# Altium project ENGG2800 Team 03 PCB.PrjPcb
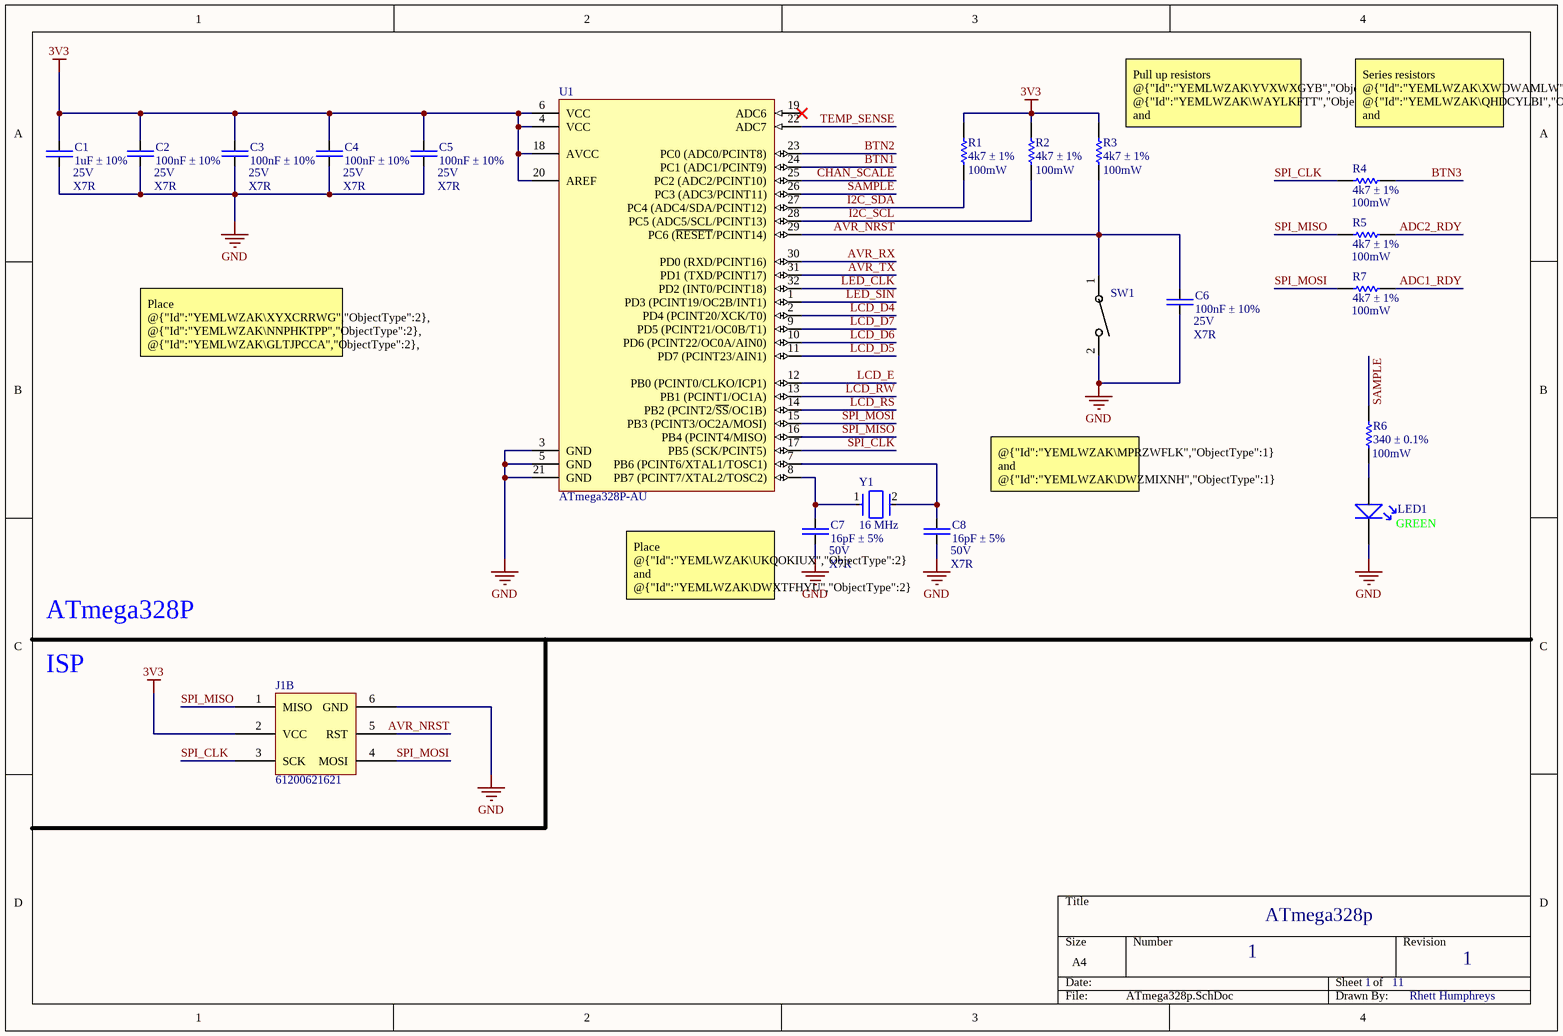
[diagram p0: ATmega328p.SchDoc]
11 sheets, 237 parts. Net scope: global (net labels, ports and power ports of the same name join across sheets).
Board file: PCB.PcbDoc
Sheets:
  ATmega328p.SchDoc
  Seeeduino and Temp.SchDoc
  Channels [1,2].SchDoc
  Channels [3,4].SchDoc
  ADC.SchDoc
  Alarms and Buttons.SchDoc
  Accelerometer.SchDoc
  LCD.SchDoc
  Power.SchDoc
  Hardware.SchDoc
  Cables.SchDoc

## Sheet ATmega328p.SchDoc: ATmega328p and Seeeduino
size A4; DocumentNumber: 1; Revision: 1; SheetNumber: 1; SheetTotal: 11

### Parts
C1  1uF ± 10%  [CAP-0805]
C2  100nF ± 10%  [CAP-0603]
C3  100nF ± 10%  [CAP-0603]
C4  100nF ± 10%  [CAP-0603]
C5  100nF ± 10%  [CAP-0603]
C6  100nF ± 10%  [CAP-0603]
C7  16pF ± 5%  [CAP-0603]
C8  16pF ± 5%  [CAP-0603]
J1  61200621621  [61200621621]  (part B of 2)
LED1  (no value)  [0603 LED]
R1  4k7 ± 1%  [RES-0603]
R2  4k7 ± 1%  [RES-0603]
R3  4k7 ± 1%  [RES-0603]
R4  4k7 ± 1%  [RES-0603]
R5  4k7 ± 1%  [RES-0603]
R6  340 ± 0.1%  [RES-0603]
R7  4k7 ± 1%  [RES-0603]
SW1  PTS636SK43JSMTRLFS  [SW_PTS636S-J_CNK]  (value not drawn)
U1  ATmega328P-AU  [32A_M]
Y1  16 MHz  [FP-ABM7-MFG]

### Nets
3V3: C1.2 C2.2 C3.2 C4.2 C5.2 J1.2(VCC) R1.1 R2.1 R3.1 U1.4(VCC) U1.6(VCC) U1.18(AVCC) U1.20(AREF)
GND: C1.1 C2.1 C3.1 C4.1 C5.1 C6.1 C7.1 C8.1 J1.6(GND) LED1.2 SW1.2 U1.3(GND) U1.5(GND) U1.21(GND)
ADC1_RDY: R7.2
ADC2_RDY: R5.2
AVR_NRST: C6.2 J1.5(RST) R3.2 SW1.1 U1.29(PC6_(~{RESET}/PCINT14))
AVR_RX: U1.30(PD0_(RXD/PCINT16))
AVR_TX: U1.31(PD1_(TXD/PCINT17))
BTN1: U1.24(PC1_(ADC1/PCINT9))
BTN2: U1.23(PC0_(ADC0/PCINT8))
BTN3: R4.2
CHAN_SCALE: U1.25(PC2_(ADC2/PCINT10))
I2C_SCL: R2.2 U1.28(PC5_(ADC5/SCL/PCINT13))
I2C_SDA: R1.2 U1.27(PC4_(ADC4/SDA/PCINT12))
LCD_D4: U1.2(PD4_(PCINT20/XCK/T0))
LCD_D5: U1.11(PD7_(PCINT23/AIN1))
LCD_D6: U1.10(PD6_(PCINT22/OC0A/AIN0))
LCD_D7: U1.9(PD5_(PCINT21/OC0B/T1))
LCD_E: U1.12(PB0_(PCINT0/CLKO/ICP1))
LCD_RS: U1.14(PB2_(PCINT2/~{SS}/OC1B))
LCD_RW: U1.13(PB1_(PCINT1/OC1A))
LED_CLK: U1.32(PD2_(INT0/PCINT18))
LED_SIN: U1.1(PD3_(PCINT19/OC2B/INT1))
SAMPLE: R6.1 U1.26(PC3_(ADC3/PCINT11))
SPI_CLK: J1.3(SCK) R4.1 U1.17(PB5_(SCK/PCINT5))
SPI_MISO: J1.1(MISO) R5.1 U1.16(PB4_(PCINT4/MISO))
SPI_MOSI: J1.4(MOSI) R7.1 U1.15(PB3_(PCINT3/OC2A/MOSI))
TEMP_SENSE: U1.22(ADC7)
NetC7_2: C7.2 U1.8(PB7_(PCINT7/XTAL2/TOSC2)) Y1.1
NetC8_2: C8.2 U1.7(PB6_(PCINT6/XTAL1/TOSC1)) Y1.2
NetLED1_1: LED1.1 R6.2

Not connected (* = marked no-connect by the designer): U1 19(ADC6)*

### Notes on the sheet
- (near C1) 25V
- (near C2) 25V
- (near C3) 25V
- (near C4) 25V
- (near C5) 25V
- (near R1) 100mW
- (near R2) 100mW
- (near R3) 100mW
- (near R3) Pull up resistors @{"Id":"YEMLWZAK\YVXWXGYB","ObjectType":2}, @{"Id":"YEMLWZAK\WAYLKFTT","ObjectType":2} and @{"Id":"YEMLWZAK\NGWYUVVG","ObjectType":2} for I2C bus signals @{"Id":"JIGDRHWK\IIGRDYOB","ObjectType":1}, @{"Id":"JIGDRHWK\FTFHPBWY","ObjectType":1} and @{"Id":"YEMLWZAK\QSTGJNDM","ObjectType":1}
- Series resistors @{"Id":"YEMLWZAK\XWDWAMLW","ObjectType":2}, @{"Id":"YEMLWZAK\QHDCYLBI","ObjectType":2} and @{"Id":"YEMLWZAK\KNMCQFHG","ObjectType":2} to protect lines connected to SPI programming lines
- (near C1) X7R
- (near C2) X7R
- (near C3) X7R
- (near C4) X7R
- (near C5) X7R
- 100mW
- (near R7) 100mW
- Place @{"Id":"YEMLWZAK\XYXCRRWG","ObjectType":2}, @{"Id":"YEMLWZAK\NNPHKTPP","ObjectType":2}, @{"Id":"YEMLWZAK\GLTJPCCA","ObjectType":2}, @{"Id":"YEMLWZAK\HCRQOYSD","ObjectType":2} as close as possible to VCC, AVCC and AREF pins of @{"Id":"YEMLWZAK\HIGJTEGZ","ObjectType":2} as possible. Place @{"Id":"YEMLWZAK\RMDZLOSG","ObjectType":2} relatively close to @{"Id":"YEMLWZAK\HIGJTEGZ","ObjectType":2}
- (near C6) X7R
- (near C6) 25V
- @{"Id":"YEMLWZAK\MPRZWFLK","ObjectType":1} and @{"Id":"YEMLWZAK\DWZMIXNH","ObjectType":1} have been swapped to assist with routing
- (near R6) 100mW
- (near C7) X7R
- (near C7) 50V
- (near C8) X7R
- (near C8) 50V
- (near LED1) GREEN
- ATmega328P
- Place @{"Id":"YEMLWZAK\UKQOKIUX","ObjectType":2} and @{"Id":"YEMLWZAK\DWXTFHYU","ObjectType":2} as close to @{"Id":"YEMLWZAK\STRTPVYI","ObjectType":2} as possible. Place @{"Id":"YEMLWZAK\STRTPVYI","ObjectType":2} as close to @{"Id":"YEMLWZAK\HIGJTEGZ","ObjectType":2} as possible
- ISP
- ATmega328p
- 1
- 11
- Rhett Humphreys

### Library data of the parts
C1 = CAP-0805: Capacitor chip unpolarized. 0603
C2-C8 = CAP-0603: Capacitor chip unpolarized. 0603
LED1 = 0603 LED
R1-R7 = RES-0603: Resistor chip. 0603
SW1 = PTS636SK43JSMTRLFS: No Description Available; Mfr_Name: C&K Components; Type: Tactile Switches
U1 = CMP-0095-00269-2: 8-bit AVR Microcontroller, 32KB Flash, 1KB EEPROM, 2KB SRAM, 32-pin TQFP, Industrial Grade (-40°C to 85°C); PackageDescription: 32-Lead, 7x7x1.0 mm Body, 0.8mm Lead Pitch, Thin Profile Plastic Quad Flat Package (TQFP); DatasheetVersion: revD, May-2011; RevisionNote: DatasheetVersion & PackageVersion updated. URLs added.; ComponentLink1URL: http://www.atmel.com/; ComponentLink2Description: ATmega48A/48PA/88A/88PA/168A/168PA/328/328P Datasheet; Code_JEDEC: MS-026-ABA; ComponentLink1Description: Manufacturer URL; PackageReference: 32A; ComponentLink3Description: ATmega48A/48PA/88A/88PA/168A/168PA/328/328P Summary; ComponentLink2URL: http://www.atmel.com/dyn/resources/prod_documents/doc8271.pdf; PackageVersion: revC, Oct-2010; ComponentLink3URL: http://www.atmel.com/dyn/resources/prod_documents/8271S.pdf
Y1 = CMP-27762-000095-1: Crystal 16MHz ±20ppm 18pF SMD-2 6mm x 3.5mm; ESR (Equivalent Series Resistance): 50R; Frequency Stability: 30ppm; Width: 3.3mm; Frequency: 16MHz; Radiation Hardening: No; Height: 0.055inch; Tolerance: 20ppm; Length: 6mm; Case/Package: CSMD; Lead Free: Lead Free; Min Operating Temperature: -40°C; Termination: SMD/SMT; Operating Frequency: 16 MHz; Resistor Type: Ceramic; Packaging: Tape and Reel; Mount: Surface Mount; Load Capacitance: 18pF; Frequency Tolerance: 20ppm; Depth: 3.5mm; Series: ABM7; Package Quantity: 1000; Max Operating Temperature: 85°C; Number of Pins: 2

## Sheet Seeeduino and Temp.SchDoc
size A4; DocumentNumber: 2; SheetNumber: 2; SheetTotal: 11
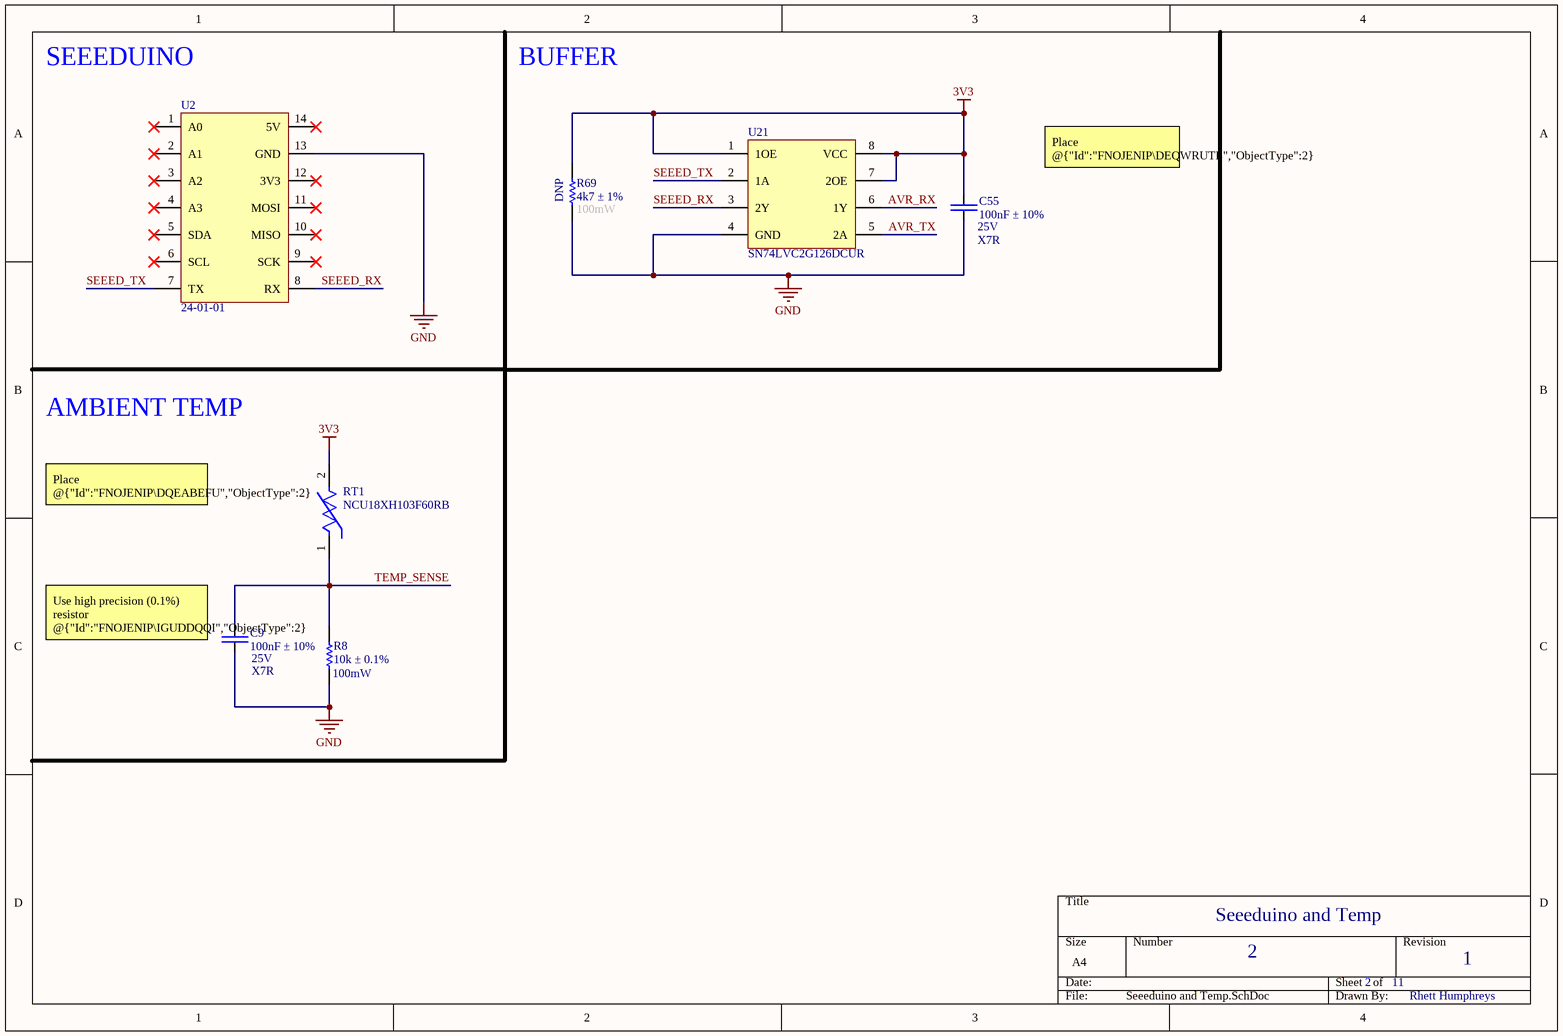
[diagram p1: Seeeduino and Temp.SchDoc]

### Parts
C9  100nF ± 10%  [CAP-0603]
C55  100nF ± 10%  [CAP-0603]
R8  10k ± 0.1%  [RES-0603]
R69  4k7 ± 1%  [RES-0603]
RT1  NCU18XH103F60RB  [FP-NCU18-0_15-MFG]
U2  24-01-01  [SEEEDUINO XIAO]
U21  SN74LVC2G126DCUR  [TSSOP50P310X90-8N]

### Nets
3V3: C55.2 R69.1 RT1.2 U21.1(1OE) U21.7(2OE) U21.8(VCC)
GND: C9.1 C55.1 R8.2 R69.2 U2.13(GND) U21.4(GND)
AVR_RX: U21.6(1Y)
AVR_TX: U21.5(2A)
SEEED_RX: U2.8(RX) U21.3(2Y)
SEEED_TX: U2.7(TX) U21.2(1A)
TEMP_SENSE: C9.2 R8.1 RT1.1

Not connected (* = marked no-connect by the designer): U2 1(A0)* 2(A1)* 3(A2)* 4(A3)* 5(SDA)* 6(SCL)* 9(SCK)* 10(MISO)* 11(MOSI)* 12(3V3)* 14(5V)*

### Notes on the sheet
- SEEEDUINO
- BUFFER
- Place @{"Id":"FNOJENIP\DEQWRUTL","ObjectType":2} as close as possible to @{"Id":"FNOJENIP\KYCZRSMO","ObjectType":2}
- (near R69) DNP
- (near R69) 100mW
- (near C55) X7R
- (near C55) 25V
- AMBIENT TEMP
- Place @{"Id":"FNOJENIP\DQEABEFU","ObjectType":2} as close as possible to @{"Id":"YEMLWZAK\HIGJTEGZ","ObjectType":2}
- (near C9) Use high precision (0.1%) resistor @{"Id":"FNOJENIP\IGUDDQQI","ObjectType":2} to form divider with @{"Id":"FNOJENIP\MLOTZGQT","ObjectType":2}
- (near C9) X7R
- (near C9) 25V
- (near R8) 100mW
- Seeeduino and Temp
- 2
- 11
- 1
- Rhett Humphreys

### Library data of the parts
C9 C55 = CAP-0603: Capacitor chip unpolarized. 0603
R8 R69 = RES-0603: Resistor chip. 0603
RT1 = CMP-06022-000443-2: THERMISTOR NTC; Max Operating Temperature: 125°C; REACH SVHC: No SVHC; Case/Package: 0603; Min Operating Temperature: -40°C; RoHS Compliant: Yes; Case Code (Imperial): 0603; Case Code (Metric): 1608
U2 = SEEDUINO XIAO

## Sheet Channels [1,2].SchDoc
size A4; DocumentNumber: 3; SheetNumber: 3; SheetTotal: 11
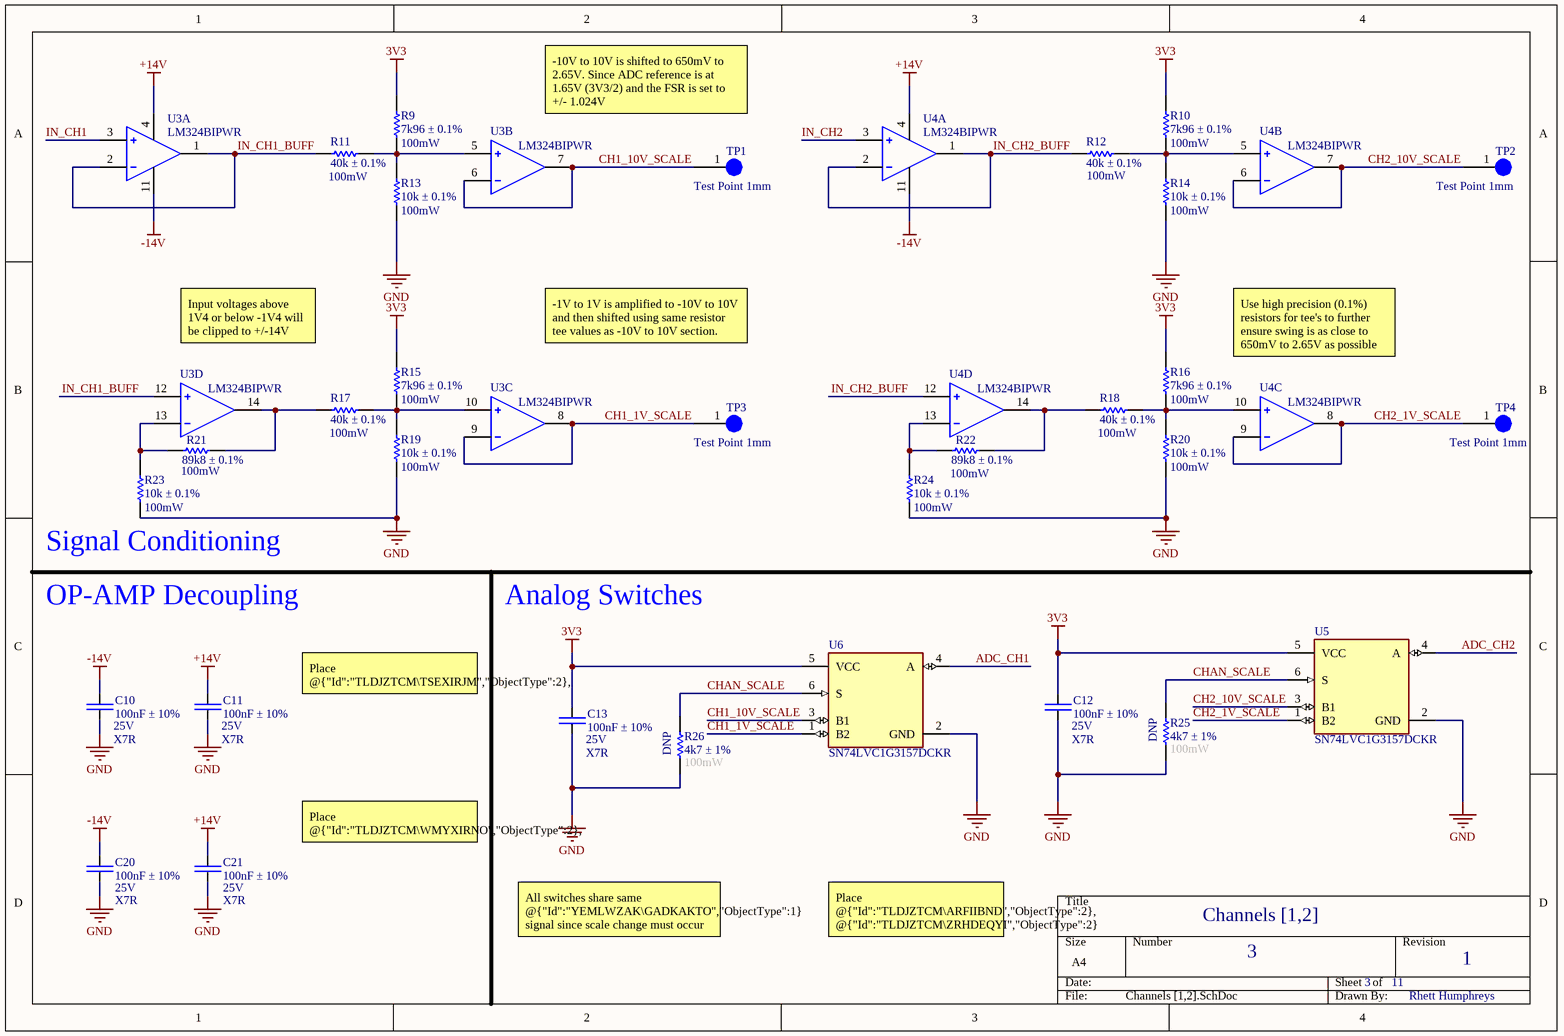
[diagram p2: Channels [1,2].SchDoc]

### Parts
C10  100nF ± 10%  [CAP-0603]
C11  100nF ± 10%  [CAP-0603]
C12  100nF ± 10%  [CAP-0603]
C13  100nF ± 10%  [CAP-0603]
C20  100nF ± 10%  [CAP-0603]
C21  100nF ± 10%  [CAP-0603]
R9  7k96 ± 0.1%  [RES-0603]
R10  7k96 ± 0.1%  [RES-0603]
R11  40k ± 0.1%  [RES-0603]
R12  40k ± 0.1%  [RES-0603]
R13  10k ± 0.1%  [RES-0603]
R14  10k ± 0.1%  [RES-0603]
R15  7k96 ± 0.1%  [RES-0603]
R16  7k96 ± 0.1%  [RES-0603]
R17  40k ± 0.1%  [RES-0603]
R18  40k ± 0.1%  [RES-0603]
R19  10k ± 0.1%  [RES-0603]
R20  10k ± 0.1%  [RES-0603]
R21  89k8 ± 0.1%  [RES-0603]
R22  89k8 ± 0.1%  [RES-0603]
R23  10k ± 0.1%  [RES-0603]
R24  10k ± 0.1%  [RES-0603]
R25  4k7 ± 1%  [RES-0603]
R26  4k7 ± 1%  [RES-0603]
TP1  Test Point 1mm  [Test Point 1mm]
TP2  Test Point 1mm  [Test Point 1mm]
TP3  Test Point 1mm  [Test Point 1mm]
TP4  Test Point 1mm  [Test Point 1mm]
U3  LM324BIPWR  [FP-PW0014A-MFG]  (parts A,B,C,D of 4)
U4  LM324BIPWR  [FP-PW0014A-MFG]  (parts A,B,C,D of 4)
U5  SN74LVC1G3157DCKR  [FP-DCK0006A-IPC_B]
U6  SN74LVC1G3157DCKR  [FP-DCK0006A-IPC_B]

### Nets
3V3: C12.2 C13.2 R9.1 R10.1 R15.1 R16.1 U5.5(VCC) U6.5(VCC)
+14V: C11.2 C21.2 U3.4(VCC+) U4.4(VCC+)
-14V: C10.2 C20.2 U3.11(VCC-) U4.11(VCC-)
GND: C10.1 C11.1 C12.1 C13.1 C20.1 C21.1 R13.2 R14.2 R19.2 R20.2 R23.2 R24.2 R25.2 R26.2 U5.2(GND) U6.2(GND)
ADC_CH1: U6.4(A)
ADC_CH2: U5.4(A)
CH1_1V_SCALE: TP3.1 U3.8(3OUT) U3.9(3IN-) U6.1(B2)
CH1_10V_SCALE: TP1.1 U3.6(2IN-) U3.7(2OUT) U6.3(B1)
CH2_1V_SCALE: TP4.1 U4.8(3OUT) U4.9(3IN-) U5.1(B2)
CH2_10V_SCALE: TP2.1 U4.6(2IN-) U4.7(2OUT) U5.3(B1)
CHAN_SCALE: R25.1 R26.1 U5.6(S) U6.6(S)
IN_CH1: U3.3(1IN+)
IN_CH1_BUFF: R11.2 U3.1(1OUT) U3.2(1IN-) U3.12(4IN+)
IN_CH2: U4.3(1IN+)
IN_CH2_BUFF: R12.2 U4.1(1OUT) U4.2(1IN-) U4.12(4IN+)
NetR9_2: R9.2 R11.1 R13.1 U3.5(2IN+)
NetR10_2: R10.2 R12.1 R14.1 U4.5(2IN+)
NetR15_2: R15.2 R17.1 R19.1 U3.10(3IN+)
NetR16_2: R16.2 R18.1 R20.1 U4.10(3IN+)
NetR17_2: R17.2 R21.1 U3.14(4OUT)
NetR18_2: R18.2 R22.1 U4.14(4OUT)
NetR21_2: R21.2 R23.1 U3.13(4IN-)
NetR22_2: R22.2 R24.1 U4.13(4IN-)

### Notes on the sheet
- -10V to 10V is shifted to 650mV to 2.65V. Since ADC reference is at 1.65V (3V3/2) and the FSR is set to +/- 1.024V
- (near R11) 100mW
- (near R9) 100mW
- (near R12) 100mW
- (near R10) 100mW
- (near R13) 100mW
- (near R14) 100mW
- Input voltages above 1V4 or below -1V4 will be clipped to +/-14V
- -1V to 1V is amplified to -10V to 10V and then shifted using same resistor tee values as -10V to 10V section.
- Use high precision (0.1%) resistors for tee's to further ensure swing is as close to 650mV to 2.65V as possible
- (near R17) 100mW
- (near R15) 100mW
- (near R18) 100mW
- (near R16) 100mW
- (near R23) 100mW
- (near R21) 100mW
- (near R19) 100mW
- (near R24) 100mW
- (near R22) 100mW
- (near R20) 100mW
- (near R23) Signal Conditioning
- OP-AMP Decoupling
- Analog Switches
- Place @{"Id":"TLDJZTCM\TSEXIRJM","ObjectType":2}, @{"Id":"TLDJZTCM\LSKHBFHO","ObjectType":2} as close as possible to @{"Id":"TLDJZTCM\QXNYIEIL","ObjectType":2}
- (near C10) X7R
- (near C10) 25V
- (near C11) X7R
- (near C11) 25V
- (near C13) X7R
- (near C13) 25V
- (near R26) DNP
- (near R26) 100mW
- (near C12) X7R
- (near C12) 25V
- (near R25) DNP
- (near R25) 100mW
- Place @{"Id":"TLDJZTCM\WMYXIRNO","ObjectType":2}, @{"Id":"TLDJZTCM\EVSPQWQB","ObjectType":2} as close as possible to @{"Id":"TLDJZTCM\DEGCNGJX","ObjectType":2}
- (near C20) X7R
- (near C20) 25V
- (near C21) X7R
- (near C21) 25V
- Channels [1,2]
- All switches share same @{"Id":"YEMLWZAK\GADKAKTO","ObjectType":1} signal since scale change must occur on all channels.
- Place @{"Id":"TLDJZTCM\ARFIIBND","ObjectType":2}, @{"Id":"TLDJZTCM\ZRHDEQYI","ObjectType":2} as close as possible to @{"Id":"TLDJZTCM\ILIOHQVR","ObjectType":2}, @{"Id":"TLDJZTCM\NPQFYXBL","ObjectType":2} respectively.
- 3
- 11
- 1
- Rhett Humphreys

### Library data of the parts
C10-C13 C20 C21 = CAP-0603: Capacitor chip unpolarized. 0603
R9-R26 = RES-0603: Resistor chip. 0603
U3 U4 = CMP-00370-131314463-1: LM324BIPWR Quad, 36-V, 1.2-MHz 3-mV offset voltage operational amplifier 14-TSSOP -40 to 85; Manufacturer Lifecycle Status: ACTIVE; Number of Pins: 14; NexarPartId: 131314463; Height: 1.2mm; Thickness: 1mm; Length: 5mm; Lifecycle Status: Production; Width: 4.4mm; Case/Package: TSSOP
U5 U6 = CMP-0859-00516-4: IC SWITCH SPDT SC70-6; Nominal Supply Current: 10uA; Number of Inputs: 1; Supply Type: Single; Operating Supply Current: 1uA; Polarity: Non-Inverting; Low Level Output Current: 128mA; Bandwidth: 300MHz; Max Supply Voltage: 5.5V; Turn-Off Delay Time: 3.8ns; Turn-On Delay Time: 5.7ns; Number of Outputs: 2; Min Supply Voltage: 1.65V; Propagation Delay: 300ps; On-State Resistance: 15R; Mount: Surface Mount; Throw Configuration: SPDT; Min Operating Temperature: -40°C; Radiation Hardening: No; Number of Pins: 6; Case/Package: SC; Length: 2mm; Lead Free: Lead Free; REACH SVHC: No SVHC; Termination: SMD/SMT; High Level Output Current: 128mA; Height: 0.9mm; Weight: 8.8E-05oz; Package Quantity: 3000; Number of Channels: 1; Packaging: Tape and Reel; Number of Bits: 1; Width: 1.25mm; Max Operating Temperature: 125°C; Max Supply Current: 10uA; Contact Plating: Gold; RoHS Compliant: Yes

## Sheet Channels [3,4].SchDoc
size A4; DocumentNumber: 4; SheetNumber: 4; SheetTotal: 11
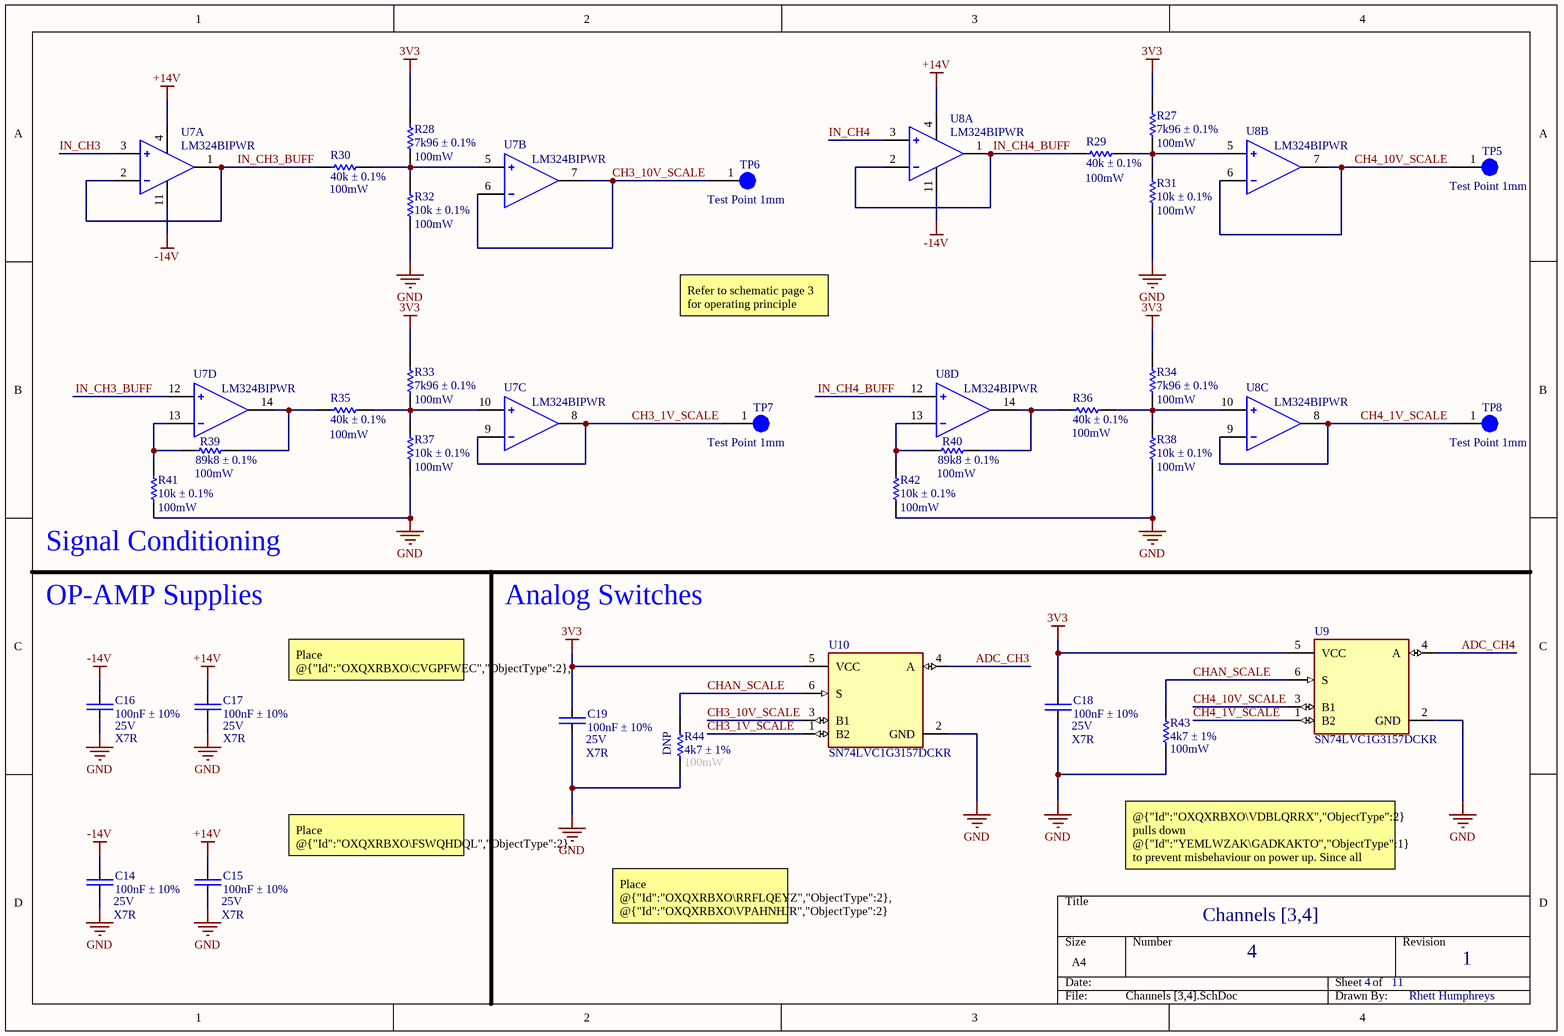
[diagram p3: Channels [3,4].SchDoc]

### Parts
C14  100nF ± 10%  [CAP-0603]
C15  100nF ± 10%  [CAP-0603]
C16  100nF ± 10%  [CAP-0603]
C17  100nF ± 10%  [CAP-0603]
C18  100nF ± 10%  [CAP-0603]
C19  100nF ± 10%  [CAP-0603]
R27  7k96 ± 0.1%  [RES-0603]
R28  7k96 ± 0.1%  [RES-0603]
R29  40k ± 0.1%  [RES-0603]
R30  40k ± 0.1%  [RES-0603]
R31  10k ± 0.1%  [RES-0603]
R32  10k ± 0.1%  [RES-0603]
R33  7k96 ± 0.1%  [RES-0603]
R34  7k96 ± 0.1%  [RES-0603]
R35  40k ± 0.1%  [RES-0603]
R36  40k ± 0.1%  [RES-0603]
R37  10k ± 0.1%  [RES-0603]
R38  10k ± 0.1%  [RES-0603]
R39  89k8 ± 0.1%  [RES-0603]
R40  89k8 ± 0.1%  [RES-0603]
R41  10k ± 0.1%  [RES-0603]
R42  10k ± 0.1%  [RES-0603]
R43  4k7 ± 1%  [RES-0603]
R44  4k7 ± 1%  [RES-0603]
TP5  Test Point 1mm  [Test Point 1mm]
TP6  Test Point 1mm  [Test Point 1mm]
TP7  Test Point 1mm  [Test Point 1mm]
TP8  Test Point 1mm  [Test Point 1mm]
U7  LM324BIPWR  [FP-PW0014A-MFG]  (parts A,B,C,D of 4)
U8  LM324BIPWR  [FP-PW0014A-MFG]  (parts A,B,C,D of 4)
U9  SN74LVC1G3157DCKR  [FP-DCK0006A-IPC_B]
U10  SN74LVC1G3157DCKR  [FP-DCK0006A-IPC_B]

### Nets
3V3: C18.2 C19.2 R27.1 R28.1 R33.1 R34.1 U9.5(VCC) U10.5(VCC)
+14V: C15.2 C17.2 U7.4(VCC+) U8.4(VCC+)
-14V: C14.2 C16.2 U7.11(VCC-) U8.11(VCC-)
GND: C14.1 C15.1 C16.1 C17.1 C18.1 C19.1 R31.2 R32.2 R37.2 R38.2 R41.2 R42.2 R43.2 R44.2 U9.2(GND) U10.2(GND)
ADC_CH3: U10.4(A)
ADC_CH4: U9.4(A)
CH3_1V_SCALE: TP7.1 U7.8(3OUT) U7.9(3IN-) U10.1(B2)
CH3_10V_SCALE: TP6.1 U7.6(2IN-) U7.7(2OUT) U10.3(B1)
CH4_1V_SCALE: TP8.1 U8.8(3OUT) U8.9(3IN-) U9.1(B2)
CH4_10V_SCALE: TP5.1 U8.6(2IN-) U8.7(2OUT) U9.3(B1)
CHAN_SCALE: R43.1 R44.1 U9.6(S) U10.6(S)
IN_CH3: U7.3(1IN+)
IN_CH3_BUFF: R30.2 U7.1(1OUT) U7.2(1IN-) U7.12(4IN+)
IN_CH4: U8.3(1IN+)
IN_CH4_BUFF: R29.2 U8.1(1OUT) U8.2(1IN-) U8.12(4IN+)
NetR27_2: R27.2 R29.1 R31.1 U8.5(2IN+)
NetR28_2: R28.2 R30.1 R32.1 U7.5(2IN+)
NetR33_2: R33.2 R35.1 R37.1 U7.10(3IN+)
NetR34_2: R34.2 R36.1 R38.1 U8.10(3IN+)
NetR35_2: R35.2 R39.1 U7.14(4OUT)
NetR36_2: R36.2 R40.1 U8.14(4OUT)
NetR39_2: R39.2 R41.1 U7.13(4IN-)
NetR40_2: R40.2 R42.1 U8.13(4IN-)

### Notes on the sheet
- (near R28) 100mW
- (near R29) 100mW
- (near R27) 100mW
- (near R30) 100mW
- (near R32) 100mW
- (near R31) 100mW
- Refer to schematic page 3 for operating principle
- (near R35) 100mW
- (near R33) 100mW
- (near R36) 100mW
- (near R34) 100mW
- (near R41) 100mW
- (near R39) 100mW
- (near R37) 100mW
- (near R42) 100mW
- (near R40) 100mW
- (near R38) 100mW
- (near R41) Signal Conditioning
- OP-AMP Supplies
- Analog Switches
- Place @{"Id":"OXQXRBXO\CVGPFWEC","ObjectType":2}, @{"Id":"OXQXRBXO\LDTQUHWN","ObjectType":2} as close as possible to @{"Id":"OXQXRBXO\LRRSIIMD","ObjectType":2}
- (near C16) X7R
- (near C16) 25V
- (near C17) X7R
- (near C17) 25V
- (near C19) X7R
- (near C19) 25V
- (near R44) DNP
- (near R44) 100mW
- (near C18) X7R
- (near C18) 25V
- (near R43) 100mW
- Place @{"Id":"OXQXRBXO\FSWQHDQL","ObjectType":2}, @{"Id":"OXQXRBXO\CJOMIWQG","ObjectType":2} as close as possible to @{"Id":"OXQXRBXO\YXPBCDIN","ObjectType":2}
- (near C14) X7R
- (near C14) 25V
- (near C15) X7R
- (near C15) 25V
- Place @{"Id":"OXQXRBXO\RRFLQEYZ","ObjectType":2}, @{"Id":"OXQXRBXO\VPAHNHJR","ObjectType":2} as close as possible to @{"Id":"OXQXRBXO\QNTGGKSR","ObjectType":2}, @{"Id":"OXQXRBXO\MYBQOZMJ","ObjectType":2} respectively
- @{"Id":"OXQXRBXO\VDBLQRRX","ObjectType":2} pulls down @{"Id":"YEMLWZAK\GADKAKTO","ObjectType":1} to prevent misbehaviour on power up. Since all switches share @{"Id":"YEMLWZAK\GADKAKTO","ObjectType":1} only one pull down should be populated (rest are DNP)
- Channels [3,4]
- 4
- 11
- 1
- Rhett Humphreys

### Library data of the parts
C14-C19 = CAP-0603: Capacitor chip unpolarized. 0603
R27-R44 = RES-0603: Resistor chip. 0603
U7 U8 = CMP-00370-131314463-1: as U3 on sheet Channels [1,2]; Number of Pins: 14; NexarPartId: 131314463; Height: 1.2mm; Thickness: 1mm; Length: 5mm; Lifecycle Status: Production; Width: 4.4mm; Case/Package: TSSOP
U9 U10 = CMP-0859-00516-4: as U5 on sheet Channels [1,2]; Mount: Surface Mount; Throw Configuration: SPDT; Min Operating Temperature: -40°C; Radiation Hardening: No; Number of Pins: 6; Case/Package: SC; Length: 2mm; Lead Free: Lead Free; REACH SVHC: No SVHC; Termination: SMD/SMT; High Level Output Current: 128mA; Height: 0.9mm; Weight: 8.8E-05oz; Package Quantity: 3000; Number of Channels: 1; Packaging: Tape and Reel; Number of Bits: 1; Width: 1.25mm; Max Operating Temperature: 125°C; Max Supply Current: 10uA; Contact Plating: Gold; RoHS Compliant: Yes

## Sheet ADC.SchDoc
size A4; DocumentNumber: 5; SheetNumber: 5; SheetTotal: 11
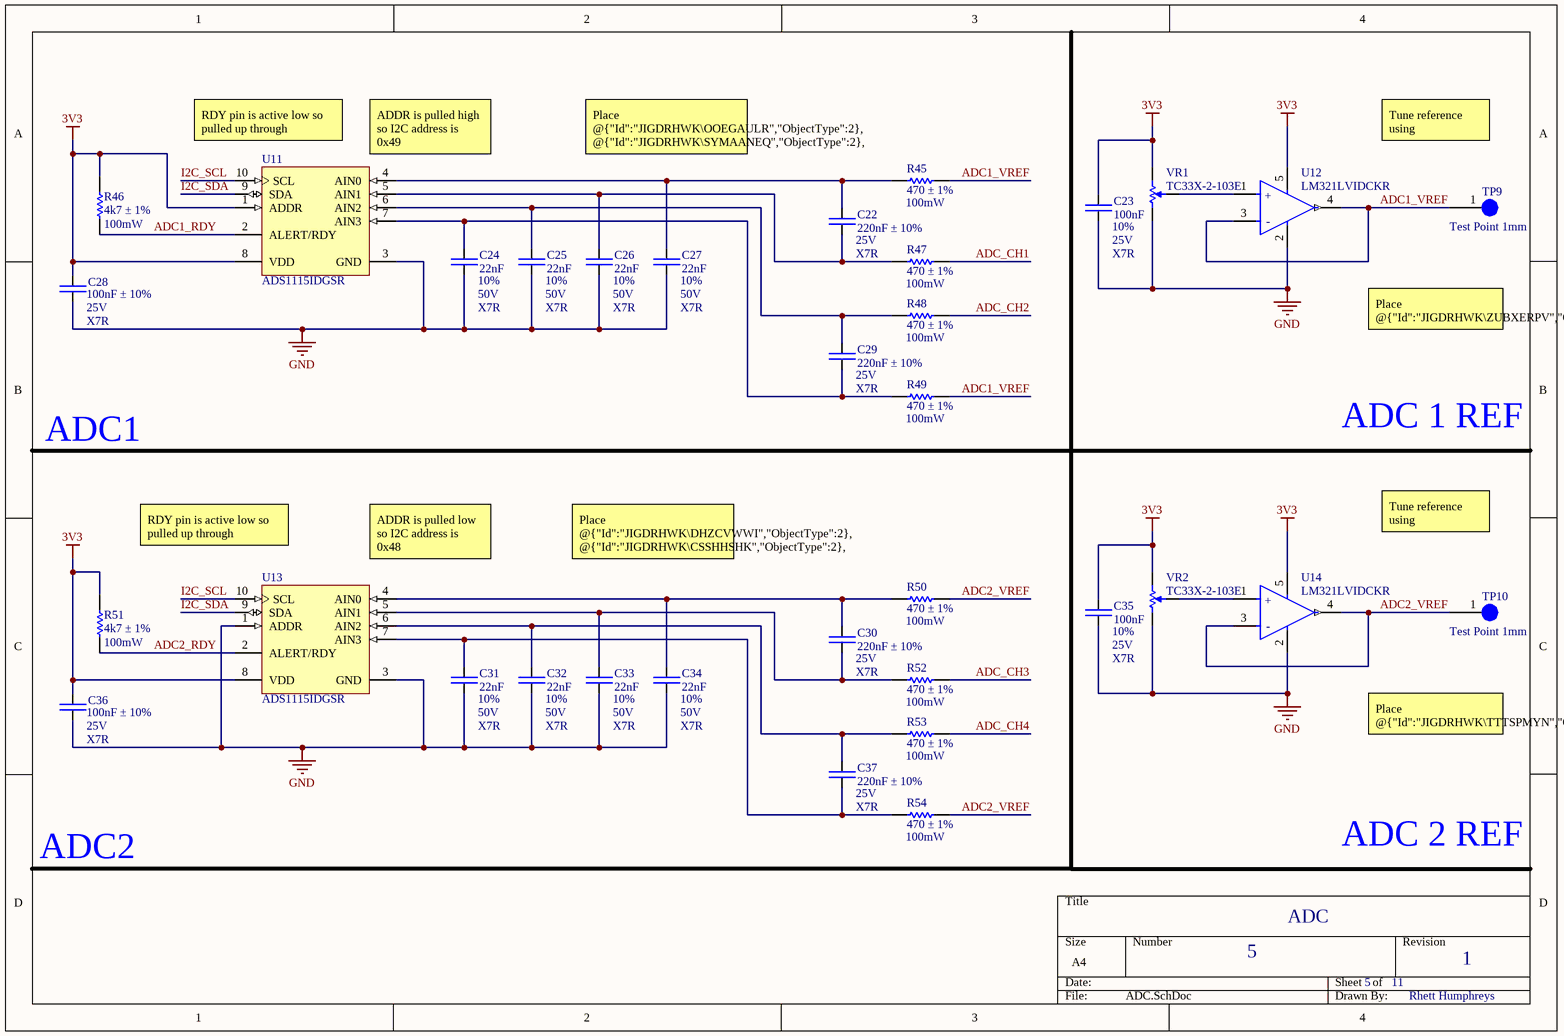
[diagram p4: ADC.SchDoc]

### Parts
C22  220nF ± 10%  [CAP-0603]
C23  100nF  [CAP-0603]
C24  22nF  [CAP-0603]
C25  22nF  [CAP-0603]
C26  22nF  [CAP-0603]
C27  22nF  [CAP-0603]
C28  100nF ± 10%  [CAP-0603]
C29  220nF ± 10%  [CAP-0603]
C30  220nF ± 10%  [CAP-0603]
C31  22nF  [CAP-0603]
C32  22nF  [CAP-0603]
C33  22nF  [CAP-0603]
C34  22nF  [CAP-0603]
C35  100nF  [CAP-0603]
C36  100nF ± 10%  [CAP-0603]
C37  220nF ± 10%  [CAP-0603]
R45  470 ± 1%  [RES-0603]
R46  4k7 ± 1%  [RES-0603]
R47  470 ± 1%  [RES-0603]
R48  470 ± 1%  [RES-0603]
R49  470 ± 1%  [RES-0603]
R50  470 ± 1%  [RES-0603]
R51  4k7 ± 1%  [RES-0603]
R52  470 ± 1%  [RES-0603]
R53  470 ± 1%  [RES-0603]
R54  470 ± 1%  [RES-0603]
TP9  Test Point 1mm  [Test Point 1mm]
TP10  Test Point 1mm  [Test Point 1mm]
U11  ADS1115IDGSR  [TI-DGS10_M]
U12  LM321LVIDCKR  [FP-DCK0005A-IPC_B]
U13  ADS1115IDGSR  [TI-DGS10_M]
U14  LM321LVIDCKR  [FP-DCK0005A-IPC_B]
VR1  TC33X-2-103E  [BOUR-TC33X-2_V]
VR2  TC33X-2-103E  [BOUR-TC33X-2_V]

### Nets
3V3: C23.2 C28.2 C35.2 C36.2 R46.2 R51.2 U11.1(ADDR) U11.8(VDD) U12.5(V+) U13.8(VDD) U14.5(V+) VR1.3 VR2.3
GND: C23.1 C24.1 C25.1 C26.1 C27.1 C28.1 C31.1 C32.1 C33.1 C34.1 C35.1 C36.1 U11.3(GND) U12.2(V-) U13.1(ADDR) U13.3(GND) U14.2(V-) VR1.1 VR2.1
ADC1_RDY: R46.1 U11.2(ALERT/RDY)
ADC1_VREF: R45.1 R49.1 TP9.1 U12.3(IN-) U12.4(OUT)
ADC2_RDY: R51.1 U13.2(ALERT/RDY)
ADC2_VREF: R50.1 R54.1 TP10.1 U14.3(IN-) U14.4(OUT)
ADC_CH1: R47.1
ADC_CH2: R48.1
ADC_CH3: R52.1
ADC_CH4: R53.1
I2C_SCL: U11.10(SCL) U13.10(SCL)
I2C_SDA: U11.9(SDA) U13.9(SDA)
NetC22_1: C22.1 C26.2 R47.2 U11.5(AIN1)
NetC22_2: C22.2 C27.2 R45.2 U11.4(AIN0)
NetC24_2: C24.2 C29.1 R49.2 U11.7(AIN3)
NetC25_2: C25.2 C29.2 R48.2 U11.6(AIN2)
NetC30_1: C30.1 C33.2 R52.2 U13.5(AIN1)
NetC30_2: C30.2 C34.2 R50.2 U13.4(AIN0)
NetC31_2: C31.2 C37.1 R54.2 U13.7(AIN3)
NetC32_2: C32.2 C37.2 R53.2 U13.6(AIN2)
NetU12_1: U12.1(IN+) VR1.2
NetU14_1: U14.1(IN+) VR2.2

### Notes on the sheet
- (near U11) RDY pin is active low so pulled up through @{"Id":"JIGDRHWK\FDMYFDDG","ObjectType":2}
- (near U11) ADDR is pulled high so I2C address is 0x49
- Place @{"Id":"JIGDRHWK\OOEGAULR","ObjectType":2}, @{"Id":"JIGDRHWK\SYMAANEQ","ObjectType":2}, @{"Id":"JIGDRHWK\AAGGNMEF","ObjectType":2}, @{"Id":"JIGDRHWK\UGRZHOXD","ObjectType":2}, @{"Id":"JIGDRHWK\DCBYKJZT","ObjectType":2} as close as possible to @{"Id":"JIGDRHWK\WCYDYSLL","ObjectType":2}
- Tune reference using @{"Id":"JIGDRHWK\DSXTIIZW","ObjectType":2}
- (near R46) 100mW
- (near C22) 25V
- (near R45) 100mW
- (near C23) 10%
- 25V
- (near C28) 25V
- (near C24) 10%
- (near C24) 50V
- X7R
- (near C25) 10%
- (near C25) 50V
- (near C26) 10%
- (near C26) 50V
- (near C27) 10%
- (near C27) 50V
- (near C27) X7R
- 100mW
- (near C28) X7R
- (near C29) 25V
- (near R48) 100mW
- Place @{"Id":"JIGDRHWK\ZUBXERPV","ObjectType":2} as close as possible to @{"Id":"JIGDRHWK\YBGBTBIW","ObjectType":2}
- ADC1
- (near R49) 100mW
- ADC 1 REF
- RDY pin is active low so pulled up through @{"Id":"JIGDRHWK\ISGETNFF","ObjectType":2}
- (near U13) ADDR is pulled low so I2C address is 0x48
- Place @{"Id":"JIGDRHWK\DHZCVWWI","ObjectType":2}, @{"Id":"JIGDRHWK\CSSHHSHK","ObjectType":2}, @{"Id":"JIGDRHWK\WRWKHIOI","ObjectType":2}, @{"Id":"JIGDRHWK\PDEQPWGA","ObjectType":2} and @{"Id":"JIGDRHWK\TQXSGOFX","ObjectType":2} as close as possible to @{"Id":"JIGDRHWK\XZUDINLW","ObjectType":2}
- Tune reference using @{"Id":"JIGDRHWK\HTVWDZPW","ObjectType":2}
- (near R51) 100mW
- (near R50) 100mW
- (near C35) 10%
- (near C31) 10%
- (near C31) 50V
- (near C32) 10%
- (near C32) 50V
- (near C33) 10%
- (near C33) 50V
- (near C34) 10%
- (near C34) 50V
- (near C30) 25V
- (near C36) 25V
- (near C36) X7R
- (near C34) X7R
- (near R53) 100mW
- Place @{"Id":"JIGDRHWK\TTTSPMYN","ObjectType":2} as close as possible to @{"Id":"JIGDRHWK\NQPUVNHB","ObjectType":2}
- (near C37) 25V
- (near R54) 100mW
- ADC 2 REF
- ADC2
- ADC
- 5
- 11
- 1
- Rhett Humphreys
- (in symbol CMP-04895-000147-1) +; -

### Library data of the parts
C22-C37 = CAP-0603: Capacitor chip unpolarized. 0603
R45-R54 = RES-0603: Resistor chip. 0603
U11 U13 = CMP-0003-00378-2: 16-Bit ADC with Integrated Multiplexer, PGA, Comparator, Oscillator, and Reference, -40 to 125 degC, 10-pin SOP (DGS10), Green (RoHS & no Sb/Br); PartNumber: ADS1115IDGST; Manufacturer: Texas Instruments; Sample Rate (max)(SPS): 860; SubFamily: Precision ADC (<=10MSPS); Architecture: Delta-Sigma; Digital Supply(Min)(V): 2; Resolution(Bits): 16; Digital Supply(Max)(V): 5.5; INL(Max)(+/-LSB): 1; Interface: Serial I2C; # Input Channels: 4; Eco-Plan: Green (RoHS & no Sb/Br); PackageDescription: 10-Pin Plastic Small Outline, Body 3 x 3 mm, Pitch 0.5 mm; Mounting Technology: Surface Mount; PackageReference: DGS10; DatasheetVersion: SBAS444B; ComponentLink3Description: Package Specification; ComponentLink1Description: Manufacturer URL; ComponentLink3URL: http://www.ti.com/lit/ml/mpds035b/mpds035b.pdf; ComponentLink2URL: http://www.ti.com/general/docs/lit/getliterature.tsp?genericPartNumber=ADS1115&fileType=pdf; Analog Voltage AV/DD(Min)(V): 2; ComponentLink2Description: Datasheet; PackageVersion: 4073272/C, 02/2004; Analog Voltage AV/DD(Max)(V): 5.5; Code_JEDEC: MO-153; ComponentLink1URL: http://www.ti.com/
U12 U14 = CMP-04895-000147-1: IC OPAMP GP 1 CIRCUIT SC70-5; RoHS Compliant: Yes
VR1 VR2 = CMP-2100-03695-1: Trimming Potentiometer, 10000 Ohm, -40 to 100 degC, 3-Pin SMD, RoHS, Tape and Reel; Manufacturer: Bourns; Tolerance: 25%; Max Power Dissipation: 100mW; Number of Turns: 1; Resistance: 10KOhm; Temperature Coefficient: 250ppm/degreesC; Voltage Rating (DC): 50V; Datasheet URL: http://www.bourns.com/docs/Product-Datasheets/TC33.pdf; Composition: Potentiometer; Package Description: 3-Pin Surface Mount Device, Body 3.8 x 3.6 mm; Weight: 29.4mg; Power Rating: 100mW; Termination: FootPrint; Manufacturer URL: http://www.bourns.com/; Width: 0.118inch; Height: 0.047inch; Military Standard: Not; Radiation Hardening: No; Colour: Silver; Case/Package: SMD/SMT; Depth: 3.8mm; Min Operating Temperature: -40degC; Lead Free: LeadFree; Datasheet Version: 42583.0; REACH SVHC: NoSVHC; Length: 3mm; RoHSCompliant: true; Contact Plating: Silver; Taper: Linear; Packaging: TapeandReel; Mount: SurfaceMount; Max Operating Temperature: 100degC; Package Reference: TC33X-2; Package Quantity: 2500

## Sheet Alarms and Buttons.SchDoc
size A4; DocumentNumber: 8; SheetNumber: 6; SheetTotal: 11
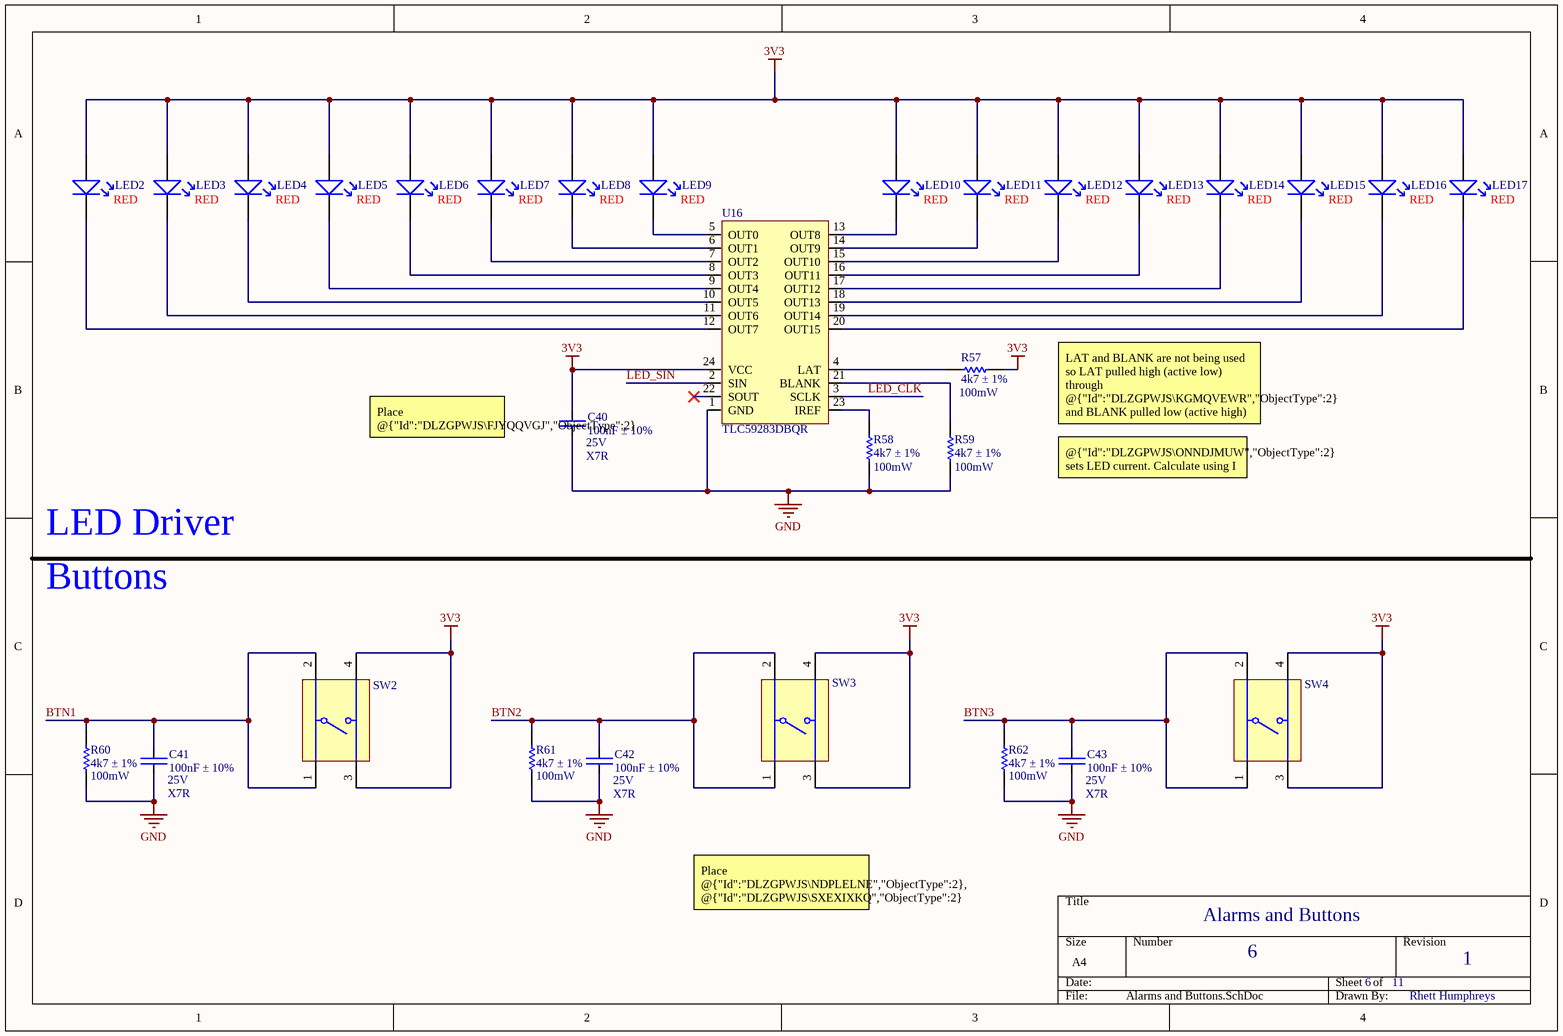
[diagram p5: Alarms and Buttons.SchDoc]

### Parts
C40  100nF ± 10%  [CAP-0603]
C41  100nF ± 10%  [CAP-0603]
C42  100nF ± 10%  [CAP-0603]
C43  100nF ± 10%  [CAP-0603]
LED2  (no value)  [0603 LED]
LED3  (no value)  [0603 LED]
LED4  (no value)  [0603 LED]
LED5  (no value)  [0603 LED]
LED6  (no value)  [0603 LED]
LED7  (no value)  [0603 LED]
LED8  (no value)  [0603 LED]
LED9  (no value)  [0603 LED]
LED10  (no value)  [0603 LED]
LED11  (no value)  [0603 LED]
LED12  (no value)  [0603 LED]
LED13  (no value)  [0603 LED]
LED14  (no value)  [0603 LED]
LED15  (no value)  [0603 LED]
LED16  (no value)  [0603 LED]
LED17  (no value)  [0603 LED]
R57  4k7 ± 1%  [RES-0603]
R58  4k7 ± 1%  [RES-0603]
R59  4k7 ± 1%  [RES-0603]
R60  4k7 ± 1%  [RES-0603]
R61  4k7 ± 1%  [RES-0603]
R62  4k7 ± 1%  [RES-0603]
SW2  FSM4JSMATR  [TECO-FSM4JSMATR_V]  (value not drawn)
SW3  FSM4JSMATR  [TECO-FSM4JSMATR_V]  (value not drawn)
SW4  FSM4JSMATR  [TECO-FSM4JSMATR_V]  (value not drawn)
U16  TLC59283DBQR  [SOP64P600X175-24N]

### Nets
3V3: C40.2 LED2.1 LED3.1 LED4.1 LED5.1 LED6.1 LED7.1 LED8.1 LED9.1 LED10.1 LED11.1 LED12.1 LED13.1 LED14.1 LED15.1 LED16.1 LED17.1 R57.2 SW2.3 SW2.4 SW3.3 SW3.4 SW4.3 SW4.4 U16.24(VCC)
GND: C40.1 C41.1 C42.1 C43.1 R58.1 R59.1 R60.2 R61.2 R62.2 U16.1(GND)
BTN1: C41.2 R60.1 SW2.1 SW2.2
BTN2: C42.2 R61.1 SW3.1 SW3.2
BTN3: C43.2 R62.1 SW4.1 SW4.2
LED_CLK: U16.3(SCLK)
LED_SIN: U16.2(SIN)
NetLED2_2: LED2.2 U16.12(OUT7)
NetLED3_2: LED3.2 U16.11(OUT6)
NetLED4_2: LED4.2 U16.10(OUT5)
NetLED5_2: LED5.2 U16.9(OUT4)
NetLED6_2: LED6.2 U16.8(OUT3)
NetLED7_2: LED7.2 U16.7(OUT2)
NetLED8_2: LED8.2 U16.6(OUT1)
NetLED9_2: LED9.2 U16.5(OUT0)
NetLED10_2: LED10.2 U16.13(OUT8)
NetLED11_2: LED11.2 U16.14(OUT9)
NetLED12_2: LED12.2 U16.15(OUT10)
NetLED13_2: LED13.2 U16.16(OUT11)
NetLED14_2: LED14.2 U16.17(OUT12)
NetLED15_2: LED15.2 U16.18(OUT13)
NetLED16_2: LED16.2 U16.19(OUT14)
NetLED17_2: LED17.2 U16.20(OUT15)
NetR57_1: R57.1 U16.4(LAT)
NetR58_2: R58.2 U16.23(IREF)
NetR59_2: R59.2 U16.21(BLANK)

Not connected (* = marked no-connect by the designer): U16 22(SOUT)*

### Notes on the sheet
- RED
- (near LED17) RED
- Place @{"Id":"DLZGPWJS\FJYQQVGJ","ObjectType":2} as close as possible to @{"Id":"DLZGPWJS\TYZPLYAJ","ObjectType":2}
- (near C40) 25V
- (near R57) 100mW
- LAT and BLANK are not being used so LAT pulled high (active low) through @{"Id":"DLZGPWJS\KGMQVEWR","ObjectType":2} and BLANK pulled low (active high) through @{"Id":"DLZGPWJS\VQHHMAKD","ObjectType":2}
- (near C40) X7R
- (near R58) 100mW
- (near R59) 100mW
- @{"Id":"DLZGPWJS\ONNDJMUW","ObjectType":2} sets LED current. Calculate using I = (43.8 * 1.208) / R_IREF.
- LED Driver
- Buttons
- (near R60) 100mW
- (near C41) 25V
- (near R61) 100mW
- (near C42) 25V
- (near R62) 100mW
- (near C43) 25V
- (near C41) X7R
- (near C42) X7R
- (near C43) X7R
- Place @{"Id":"DLZGPWJS\NDPLELNE","ObjectType":2}, @{"Id":"DLZGPWJS\SXEXIXKQ","ObjectType":2} and @{"Id":"DLZGPWJS\PBKEKCZD","ObjectType":2} as close as possible to GPIO pins used for buttons of @{"Id":"YEMLWZAK\HIGJTEGZ","ObjectType":2}
- Alarms and Buttons
- 6
- 11
- 1
- Rhett Humphreys

### Library data of the parts
C40-C43 = CAP-0603: Capacitor chip unpolarized. 0603
LED2-LED17 = 0603 LED
R57-R62 = RES-0603: Resistor chip. 0603
SW2-SW4 = CMP-2000-07486-1: Micro Miniature Push Button Switch FSM JSM, 50 mA, -35 to 85 degC, 4-Pin SMD, RoHS, Tape and Reel; Manufacturer: TE Connectivity; Mechanical Life: 100000Cycles; Current Rating: 50mA; Actuator Material: Polyamide; Max Voltage Rating (DC): 12V; Capacitance: 0f; Illumination Type: Illuminated; Voltage Rating (DC): 24V; Case\/Package: SMD/SMT; Operating Force: 160gf; Contact Resistance: 100mOhm; Actuator Length: 0.055inch; Switch Travel: 0.25mm; Throw Configuration: SPST; Termination: GullWing; Contact Plating: Silver; Orientation: Straight; Mounting Technology: SurfaceMount; REACH SVHC: Unknown; Electrical Life: 100000Cycles; Package Reference: FSM4JSMATR; Max Operating Temperature: 85degC; Manufacturer URL: http://www.te.com/; Package Description: 4-Pin Surface Mount Device, Body 6 x 6 mm, Pitch 4.5 mm; Datasheet Version: Rev. V, 02/2015; Packaging: TapeandReel; Min Operating Temperature: -35degC; Mount: SurfaceMount; Contact Current Rating: 50mA; Contact Material: CopperAlloy; Package Quantity: 1200; Datasheet URL: http://www.te.com/commerce/DocumentDelivery/DDEController?Action=showdoc&DocId=Customer+Drawing%7F2-1437565-7%7FV%7Fpdf%7FEnglish%7FENG_CD_2-1437565-7_V.pdf%7F4-1437565-2; RoHSCompliant: true
U16 = TLC59283DBQR: LED Driver Const Current 16 Output

## Sheet Accelerometer.SchDoc
size A4; DocumentNumber: 6; SheetNumber: 7; SheetTotal: 11
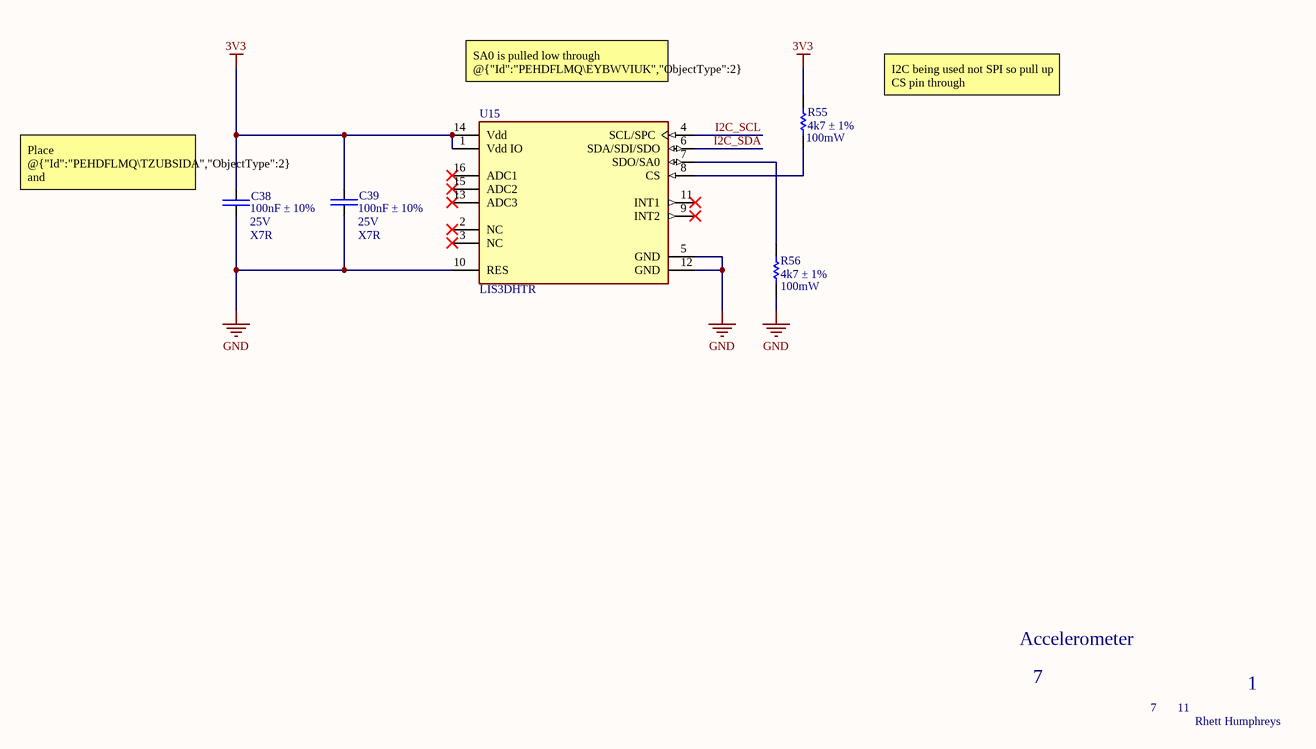
[diagram p6: Accelerometer.SchDoc]

### Parts
C38  100nF ± 10%  [CAP-0603]
C39  100nF ± 10%  [CAP-0603]
R55  4k7 ± 1%  [RESC1609X50X30NL8T20]
R56  4k7 ± 1%  [RESC1609X50X30NL8T20]
U15  LIS3DHTR  [FP-LGA-16-7983231-MFG]

### Nets
3V3: C38.2 C39.2 R55.2 U15.1(Vdd_IO) U15.14(Vdd)
GND: C38.1 C39.1 R56.1 U15.5(GND) U15.10(RES) U15.12(GND)
I2C_SCL: U15.4(SCL/SPC)
I2C_SDA: U15.6(SDA/SDI/SDO)
NetR55_1: R55.1 U15.8(CS)
NetR56_2: R56.2 U15.7(SDO/SA0)

Not connected (* = marked no-connect by the designer): U15 2(NC)* 3(NC)* 9(INT2)* 11(INT1)* 13(ADC3)* 15(ADC2)* 16(ADC1)*

### Notes on the sheet
- SA0 is pulled low through @{"Id":"PEHDFLMQ\EYBWVIUK","ObjectType":2} so I2C address is 0x18
- I2C being used not SPI so pull up CS pin through @{"Id":"PEHDFLMQ\PWWKWBSP","ObjectType":2}
- (near R55) 100mW
- (near C38) Place @{"Id":"PEHDFLMQ\TZUBSIDA","ObjectType":2} and @{"Id":"PEHDFLMQ\UJDGWTQV","ObjectType":2} as close as possible to Vdd and Vdd IO pins of @{"Id":"PEHDFLMQ\OSLWRHKS","ObjectType":2} respectively.
- (near C38) 25V
- (near C38) X7R
- (near C39) 25V
- (near C39) X7R
- (near R56) 100mW
- Accelerometer
- 7
- 11
- 1
- Rhett Humphreys

### Library data of the parts
C38 C39 = CAP-0603: Capacitor chip unpolarized. 0603
R55 R56 = CMP-1666-00005-4: Chip Resistor, 10 KOhm, +/- 1%, 100 mW, -55 to 155 degC, 0603 (1608 Metric), RoHS, Tape and Reel; Manufacturer: Vishay Semiconductor; Voltage Rating: 75 V; Max Operating Temperature: 155 degC; PackageDescription: 2-Pin Surface Mount Device, Body 1.575 x 0.85 mm; ComponentLink1Description: Manufacturer URL; RoHSCompliant: true; PackageReference: 0603; REACH SVHC: Unknown; Length: 1.55 mm; DatasheetVersion: 06/2012; Packaging: Tape and Reel; Min Operating Temperature: -55 degC; Mounting Technology: Surface Mount; ComponentLink2URL: https://datasheet.ciiva.com/11809/0900766b80d98afc-11809037.pdf; Height: 0.45 mm; ComponentLink2Description: Datasheet; Package Quantity: 5000; ComponentLink1URL: http://www.vishay.com/
U15 = CMP-0234-00055-6: ACCEL 2-16G I2C/SPI 16LGA; Max Supply Voltage: 3.6V; Bandwidth: 5kHz; Min Supply Voltage (DC): 1.71V; Interface: I2C; Axis: X, Y, Z; Operating Supply Voltage: 2.5V; Operating Supply Current: 11uA; Output Type: Digital; Resolution: 16b; Sensor Type: 3 Axis; Series: -; Package Quantity: 1; Case/Package: LGA; Radiation Hardening: No; Min Operating Temperature: -40°C; Length: 3mm; Max Supply Voltage (DC): 3.6V; Lead Free: Lead Free; Height: 1mm; Number of Pins: 16; RoHS Compliant: Yes; Packaging: Tape and Reel; Width: 3mm; Contact Plating: Gold; Max Operating Temperature: 85°C; Min Supply Voltage: 1.71V; REACH SVHC: No SVHC; Depth: 3mm

## Sheet LCD.SchDoc
size A4; DocumentNumber: 7; SheetNumber: 8; SheetTotal: 11
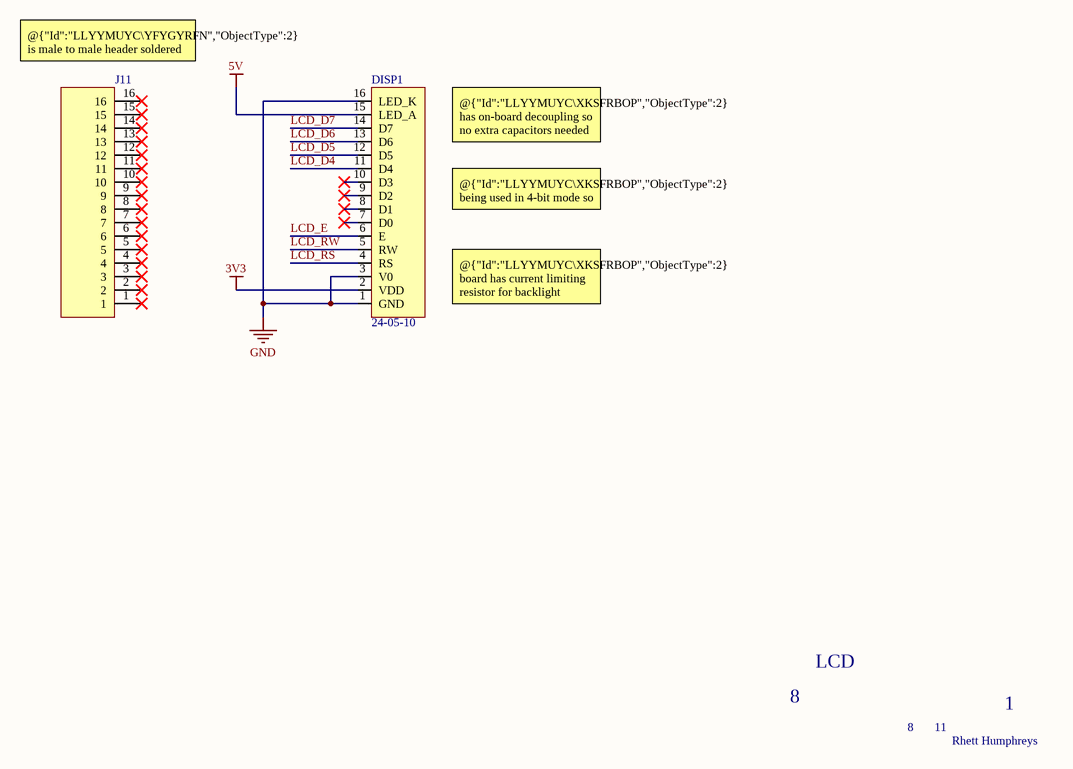
[diagram p7: LCD.SchDoc]

### Parts
DISP1  24-05-10  [ERM2004 40x2 LCD]
J11  Header, 16pos 2.54mm  (value not drawn)

### Nets
3V3: DISP1.2(VDD)
5V: DISP1.15(LED_A)
GND: DISP1.1(GND) DISP1.3(V0) DISP1.16(LED_K)
LCD_D4: DISP1.11(D4)
LCD_D5: DISP1.12(D5)
LCD_D6: DISP1.13(D6)
LCD_D7: DISP1.14(D7)
LCD_E: DISP1.6(E)
LCD_RS: DISP1.4(RS)
LCD_RW: DISP1.5(RW)

Not connected (* = marked no-connect by the designer): DISP1 7(D0)* 8(D1)* 9(D2)* 10(D3)*; J11 1* 2* 3* 4* 5* 6* 7* 8* 9* 10* 11* 12* 13* 14* 15* 16*

### Notes on the sheet
- (near J11) @{"Id":"LLYYMUYC\YFYGYRFN","ObjectType":2} is male to male header soldered to @{"Id":"LLYYMUYC\XKSFRBOP","ObjectType":2} PCB.
- @{"Id":"LLYYMUYC\XKSFRBOP","ObjectType":2} has on-board decoupling so no extra capacitors needed
- @{"Id":"LLYYMUYC\XKSFRBOP","ObjectType":2} being used in 4-bit mode so D0 to D3 are NC
- @{"Id":"LLYYMUYC\XKSFRBOP","ObjectType":2} board has current limiting resistor for backlight
- LCD
- 8
- 11
- 1
- Rhett Humphreys

### Library data of the parts
DISP1 = ERM2004 40x2 LCD

## Sheet Power.SchDoc
size A4; DocumentNumber: 9; SheetNumber: 9; SheetTotal: 11
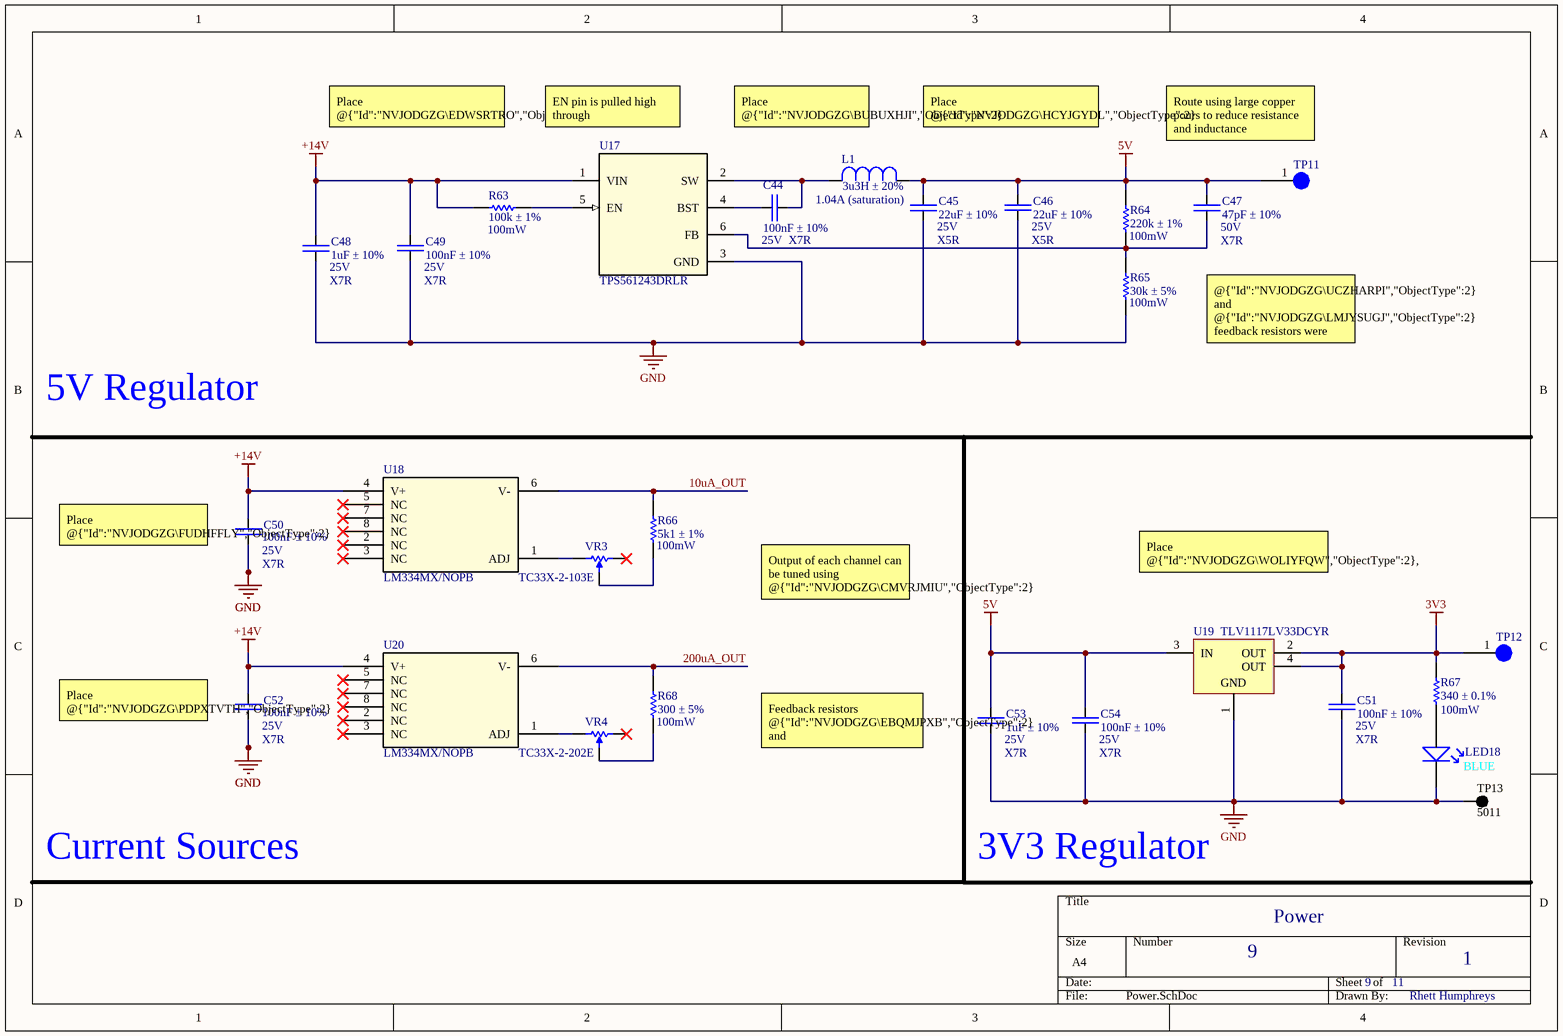
[diagram p8: Power.SchDoc]

### Parts
C44  100nF ± 10%  [CAP-0603]
C45  22uF ± 10%  [CAP-1206]
C46  22uF ± 10%  [CAP-1206]
C47  47pF ± 10%  [CAP-0603]
C48  1uF ± 10%  [CAP-0805]
C49  100nF ± 10%  [CAP-0603]
C50  100nF ± 10%  [CAP-0603]
C51  100nF ± 10%  [CAP-0603]
C52  100nF ± 10%  [CAP-0603]
C53  1uF ± 10%  [CAP-0805]
C54  100nF ± 10%  [CAP-0603]
L1  3u3H ± 20%  [IND_TAIYO_CBC3225_TAY]
LED18  (no value)  [0603 LED]
R63  100k ± 1%  [RES-0603]
R64  220k ± 1%  [RES-0603]
R65  30k ± 5%  [RES-0603]
R66  5k1 ± 1%  [RES-0603]
R67  340 ± 0.1%  [RES-0603]
R68  300 ± 5%  [RES-0603]
TP11  Test-Point 3mm  [TestPoint 3mm]  (value not drawn)
TP12  Test-Point 3mm  [TestPoint 3mm]  (value not drawn)
TP13  5011  [KSTN-5011_V]
U17  TPS561243DRLR  [DRL0006A-MFG]
U18  LM334MX/NOPB  [SO-8_STM]
U19  TLV1117LV33DCYR  [DCY0004A_N]
U20  LM334MX/NOPB  [SO-8_STM]
VR3  TC33X-2-103E  [BOUR-TC33X-2_V]
VR4  TC33X-2-202E  [BOUR-TC33X-2_V]

### Nets
3V3: C51.2 R67.1 TP12.1 U19.2(OUT) U19.4(OUT)
5V: C45.2 C46.2 C47.2 C53.2 C54.2 L1.1 R64.1 TP11.1 U19.3(IN)
+14V: C48.2 C49.2 C50.2 C52.2 R63.1 U17.1(VIN) U18.4(V+) U20.4(V+)
GND: C45.1 C46.1 C48.1 C49.1 C50.1 C51.1 C52.1 C53.1 C54.1 LED18.2 R65.2 TP13.1 U17.3(GND) U19.1(GND)
10uA_OUT: R66.1 U18.6(V-)
200uA_OUT: R68.1 U20.6(V-)
NetC44_1: C44.1 U17.4(BST)
NetC44_2: C44.2 L1.2 U17.2(SW)
NetC47_1: C47.1 R64.2 R65.1 U17.6(FB)
NetLED18_1: LED18.1 R67.2
NetR63_2: R63.2 U17.5(EN)
NetR66_2: R66.2 VR3.2
NetR68_2: R68.2 VR4.2
NetU18_1: U18.1(ADJ) VR3.1
NetU20_1: U20.1(ADJ) VR4.1

Not connected (* = marked no-connect by the designer): U18 2(NC)* 3(NC)* 5(NC)* 7(NC)* 8(NC)*; U20 2(NC)* 3(NC)* 5(NC)* 7(NC)* 8(NC)*; VR3 3*; VR4 3*

### Notes on the sheet
- Place @{"Id":"NVJODGZG\EDWSRTRO","ObjectType":2} and @{"Id":"NVJODGZG\DYNYEBZW","ObjectType":2} as close to @{"Id":"NVJODGZG\DGCAJXYF","ObjectType":2} as possible.
- EN pin is pulled high through @{"Id":"NVJODGZG\YICJOSXS","ObjectType":2}
- Place @{"Id":"NVJODGZG\BUBUXHJI","ObjectType":2} as close as possible to @{"Id":"NVJODGZG\DGCAJXYF","ObjectType":2}
- Place @{"Id":"NVJODGZG\HCYJGYDL","ObjectType":2} and @{"Id":"NVJODGZG\RJYCCXAY","ObjectType":2} as close as possible to @{"Id":"NVJODGZG\BUBUXHJI","ObjectType":2}.
- Route using large copper pours to reduce resistance and inductance
- (near R63) 100mW
- (near C44) 25V
- (near C44) X7R
- (near C45) 1.04A (saturation)
- (near C45) 25V
- (near C45) X5R
- (near C46) 25V
- (near C46) X5R
- (near R64) 100mW
- (near C47) X7R
- (near C47) 50V
- (near C48) X7R
- (near C48) 25V
- (near C49) X7R
- (near C49) 25V
- (near R65) 100mW
- @{"Id":"NVJODGZG\UCZHARPI","ObjectType":2} and @{"Id":"NVJODGZG\LMJYSUGJ","ObjectType":2} feedback resistors were chosen from @{"Id":"NVJODGZG\DGCAJXYF","ObjectType":2} datasheet for 5V typical application
- 5V Regulator
- (near C50) Place @{"Id":"NVJODGZG\FUDHFFLY","ObjectType":2} as close as possible to @{"Id":"NVJODGZG\QCNKAFLE","ObjectType":2}
- (near C50) X7R
- (near C50) 25V
- (near R66) 100mW
- Place @{"Id":"NVJODGZG\WOLIYFQW","ObjectType":2}, @{"Id":"NVJODGZG\OZZOURIS","ObjectType":2} and @{"Id":"NVJODGZG\DZOAGFNU","ObjectType":2} as close as possible to @{"Id":"NVJODGZG\AHGDDYNZ","ObjectType":2}.
- Output of each channel can be tuned using @{"Id":"NVJODGZG\CMVRJMIU","ObjectType":2} and @{"Id":"NVJODGZG\MRQRDVLR","ObjectType":2}.
- (near C52) Place @{"Id":"NVJODGZG\PDPXTVTH","ObjectType":2} as close as possible to @{"Id":"NVJODGZG\HQYKOPGT","ObjectType":2}
- (near R67) 100mW
- (near C52) X7R
- (near C52) 25V
- (near R68) 100mW
- Feedback resistors @{"Id":"NVJODGZG\EBQMJPXB","ObjectType":2} and @{"Id":"NVJODGZG\ZFYMTKTE","ObjectType":2} can be calculated using R_f = 0.067 / I_set
- (near C53) X7R
- (near C53) 25V
- (near C54) X7R
- (near C54) 25V
- (near C51) X7R
- (near C51) 25V
- BLUE
- Current Sources
- 3V3 Regulator
- Power
- 9
- 11
- 1
- Rhett Humphreys

### Library data of the parts
C44 C47 C49-C52 C54 = CAP-0603: Capacitor chip unpolarized. 0603
C45 C46 = CAP-1206: Capacitor chip unpolarized. 0603
C48 C53 = CAP-0805: Capacitor chip unpolarized. 0603
L1 = CBC3225T3R3MR: No Description Available; Mfr_Name: Taiyo Yuden
LED18 = 0603 LED
R63-R68 = RES-0603: Resistor chip. 0603
TP13 = CMP-1672-00003-4: Test Point, Black, Through Hole, RoHS, Bulk; Manufacturer: Keystone; ComponentLink2URL: http://www.keyelco.com/product-pdf.cfm?p=1320; Colour: Black; Pins: 1; REACH SVHC: No SVHC; ComponentLink1URL: http://www.keyelco.com/; PackageReference: 5011; Contact Plating: Silver; Package Quantity: 100; Packaging: Bulk; RoHSCompliant: true; Height: 8.12 mm; PackageDescription: 1-Pin Through Hole Device, Dia 3.17 mm; Mount: Through Hole; Mounting Technology: Through Hole; DatasheetVersion: Rev. F, 12/2013; ComponentLink1Description: Manufacturer URL; Contact Material: Bronze; ComponentLink2Description: Datasheet
U17 = TPS561243DRLR: No Description Available; Mfr_Name: Texas Instruments; TYPE: TYPE; RefDes: RefDes
U18 U20 = LM234DT: No Description Available; Mfr_Name: STMicroelectronics; RefDes: RefDes; Type: Type
U19 = CMP-0395-00503-2: Single Output LDO, 1 A, Fixed 3.3 V Output, 2 to 5.5 V Input, 4-pin SOT-223 (DCY), -40 to 125 degC, Green (RoHS & no Sb/Br); Manufacturer: Texas Instruments; Vout Adj(Min)(V): 3.3; Vdo(Typ)(mV): 1200; Iq(Typ)(mA): 0.05; Accuracy(%): 2; Iout(Max)(A): 1; SubFamily: Single Channel LDO; Vin(Max)(V): 5.5; PackageReference: DCY0004A; PackageDescription: 4-Pin Plastic Small Outline, Body 3.5 x 6.5 mm, Pitch 2.3 mm; Vout Adj(Max)(V): 3.3; Mounting Technology: Surface Mount; ComponentLink2Description: Datasheet; ComponentLink1Description: Manufacturer URL; PartNumber: TLV1117LV33DCYR; ComponentLink3Description: Package Specification; ComponentLink1URL: http://www.ti.com/; ComponentLink2URL: http://www.ti.com/general/docs/lit/getliterature.tsp?genericPartNumber=TLV1117LV33&fileType=pdf; Fixed Output Options(V): 3.3; PackageVersion: 4202506/B; Vin(Min)(V): 2; DatasheetVersion: SBVS160A; Eco-Plan: Green (RoHS & no Sb/Br); ComponentLink3URL: http://www.ti.com/litv/pdf/mpds094a; Code_JEDEC: TO-261
VR3 VR4 = CMP-2100-03695-1: Trimming Potentiometer, 2000 Ohm, -40 to 100 degC, 3-Pin SMD, RoHS, Tape and Reel; Manufacturer: Bourns; Tolerance: 25%; Max Power Dissipation: 100mW; Number of Turns: 1; Resistance: 10KOhm; Temperature Coefficient: 250ppm/degreesC; Voltage Rating (DC): 50V; Datasheet URL: http://www.bourns.com/docs/Product-Datasheets/TC33.pdf; Composition: Potentiometer; Package Description: 3-Pin Surface Mount Device, Body 3.8 x 3.6 mm; Weight: 29.4mg; Power Rating: 100mW; Termination: FootPrint; Manufacturer URL: http://www.bourns.com/; Width: 0.118inch; Height: 0.047inch; Military Standard: Not; Radiation Hardening: No; Colour: Silver; Case/Package: SMD/SMT; Depth: 3.8mm; Min Operating Temperature: -40degC; Lead Free: LeadFree; Datasheet Version: 42583.0; REACH SVHC: NoSVHC; Length: 3mm; RoHSCompliant: true; Contact Plating: Silver; Taper: Linear; Packaging: TapeandReel; Mount: SurfaceMount; Max Operating Temperature: 100degC; Package Reference: TC33X-2; Package Quantity: 2500

## Sheet Hardware.SchDoc
size A4; DocumentNumber: 10; SheetNumber: 10; SheetTotal: 11
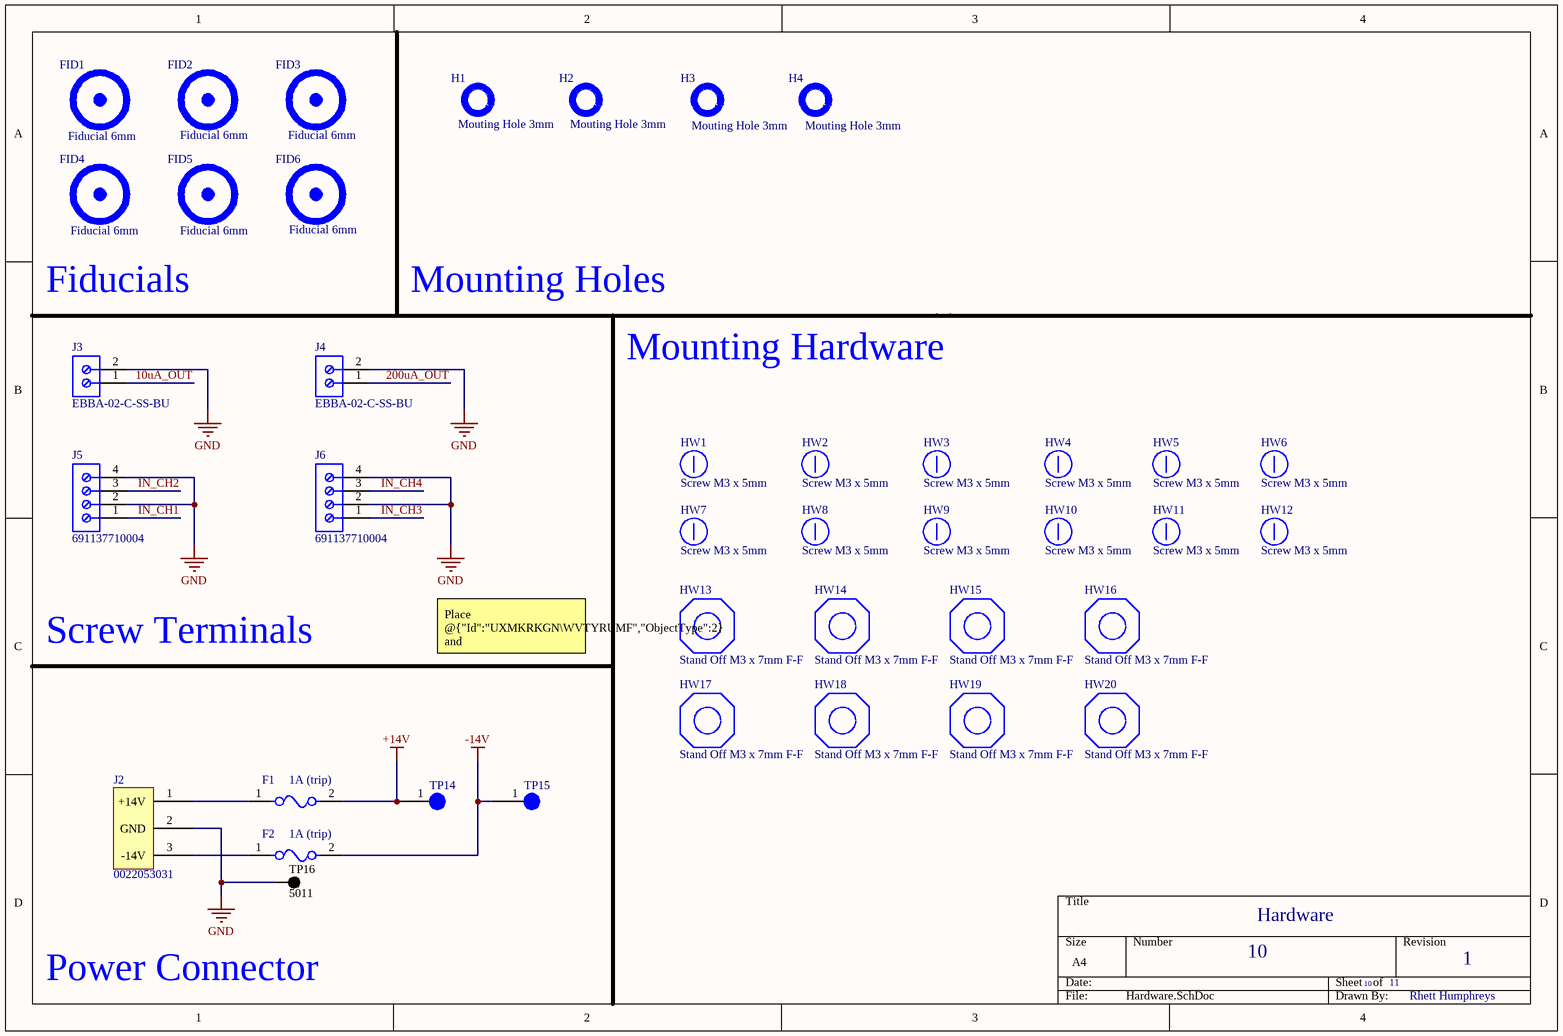
[diagram p9: Hardware.SchDoc]

### Parts
F1  1A (trip)  [FP-0466-MFG]
F2  1A (trip)  [FP-0466-MFG]
FID1  Fiducial 6mm  [Fiducial 6mm]
FID2  Fiducial 6mm  [Fiducial 6mm]
FID3  Fiducial 6mm  [Fiducial 6mm]
FID4  Fiducial 6mm  [Fiducial 6mm]
FID5  Fiducial 6mm  [Fiducial 6mm]
FID6  Fiducial 6mm  [Fiducial 6mm]
H1  Mouting Hole 3mm  [MH3]
H2  Mouting Hole 3mm  [MH3]
H3  Mouting Hole 3mm  [MH3]
H4  Mouting Hole 3mm  [MH3]
HW1  Screw M3 x 5mm
HW2  Screw M3 x 5mm
HW3  Screw M3 x 5mm
HW4  Screw M3 x 5mm
HW5  Screw M3 x 5mm
HW6  Screw M3 x 5mm
HW7  Screw M3 x 5mm
HW8  Screw M3 x 5mm
HW9  Screw M3 x 5mm
HW10  Screw M3 x 5mm
HW11  Screw M3 x 5mm
HW12  Screw M3 x 5mm
HW13  Stand Off M3 x 7mm F-F
HW14  Stand Off M3 x 7mm F-F
HW15  Stand Off M3 x 7mm F-F
HW16  Stand Off M3 x 7mm F-F
HW17  Stand Off M3 x 7mm F-F
HW18  Stand Off M3 x 7mm F-F
HW19  Stand Off M3 x 7mm F-F
HW20  Stand Off M3 x 7mm F-F
J2  0022053031  [0022053031]
J3  EBBA-02-C-SS-BU  [TECO-282836-2_V]
J4  EBBA-02-C-SS-BU  [TECO-282836-2_V]
J5  691137710004  [691137710004]
J6  691137710004  [691137710004]
TP14  Test-Point 3mm  [TestPoint 3mm]  (value not drawn)
TP15  Test-Point 3mm  [TestPoint 3mm]  (value not drawn)
TP16  5011  [KSTN-5011_V]

### Nets
+14V: F1.2 TP14.1
-14V: F2.2 TP15.1
GND: J2.2(GND) J3.2 J4.2 J5.2 J5.4 J6.2 J6.4 TP16.1
10uA_OUT: J3.1
200uA_OUT: J4.1
IN_CH1: J5.1
IN_CH2: J5.3
IN_CH3: J6.1
IN_CH4: J6.3
NetF1_1: F1.1 J2.1(+14V)
NetF2_1: F2.1 J2.3(-14V)

### Notes on the sheet
- Fiducials
- Mounting Holes
- Mounting Hardware
- Screw Terminals
- Place @{"Id":"UXMKRKGN\WVTYRUMF","ObjectType":2} and @{"Id":"UXMKRKGN\KFKNCMDB","ObjectType":2} relatively close to @{"Id":"UXMKRKGN\FYZIDNJZ","ObjectType":2} and @{"Id":"UXMKRKGN\LLHQVDIL","ObjectType":2}.
- Hardware
- Power Connector
- 10
- 11
- 1
- Rhett Humphreys

### Library data of the parts
F1 F2 = CMP-08605-000058-1: FUSE BOARD MNT 1A 63VAC/VDC 1206; Manufacturer Part Number: 0466001.NR; Manufacturer: Littelfuse Inc; Max Fuse Dc Voltage: 63V; Fuse Interrupt Ac Current: 50A; Fuse Voltage Drop: 79.97mV; Resistance: 0.075Ω; Value: 0.075Ω; Fuse I2T: 0.0423A2Sec; Fuse Blow Speed: Fast; Temperature Range High: +90°C; Max Fuse Ac Voltage: 63V; Package: 0466; ComponentLink2URL: https://www.littelfuse.com/~/media/electronics/datasheets/fuses/littelfuse_fuse_466_datasheet.pdf.pdf; Device Class L3: unset; Lead Free: Yes; Automotive: No; Digikey Description: FUSE BOARD MNT 1A 63VAC/VDC 1206; Height: 0.66mm; Temperature Range Low: -55°C; Category: Fuse; ComponentLink2Description: Datasheet; Device Class L1: Circuit Protection; Device Class L2: Fuses; Fuse Current: 1A; Mouser Description: Surface Mount Fuses 63V FA 1206 1A VFA Slimline; Octopart: https://octopart.com/0466001.nr-littelfuse-566005; Fuse Interrupt Dc Current: 50A; RoHS: TRUE; Voltage Rating: 63V; Temperature: -55°C to +90°C
H1-H4 = MH3
HW1-HW12 = Screw M3 x 5mm: Fastener flathead M3 x 5mm
HW13-HW20 = Stand Off M3 x 7mm F-F: Stand off hex M3 x 7mm
J3 J4 = CMP-1684-00017-1: Female Header, Pitch 5 mm, 1 x 2 Position, Height 10 mm, Tail Length 3.5 mm, Rohs, Bulk; Manufacturer: TE Connectivity; Wire Gauge: 16-30AWG; Product Training Modules: Wire-to-BoardEurostyleTerminalBlocks; Clamp Material - Plating: Brass-NickelPlated; Voltage: 300V; Mating Orientation: HorizontalwithBoard; Current: 13.5A; Pitch: 0.197"(5.00mm); Screw Thread: M3; 3D Model: 282836-2.pdf; Other Names: 5ULV-02B / A98076; Dynamic Catalog: BuchananSeries; Number of Levels: 1; Torque - Screw: 0.68Nm(6Lb-In); Featured Product: EurostyleTerminalBlockConnectors; Positions Per Level: 2; Wire Termination: Screw-RisingCageClamp; Datasheet URL: http://www.te.com.cn/commerce/DocumentDelivery/DDEController?Action=showdoc&DocId=Catalog+Section%7F1308389_EUROSTYLE_TERMINAL_BLOCKS%7F0607%7Fpdf%7FEnglish%7FENG_CS_1308389_EUROSTYLE_TERMINAL_BLOCKS_0607.pdf%7F282836-2; Color: Green; Family: TerminalBlocks-WiretoBoard; RoHS Information: 282836-2StatementofCompliance; Standard Package: 300; Contact Material - Plating: Brass-TinPlated; Manufacturer URL: http://www.te.com; Housing Material: Polyamide(PA66),Nylon6/6; Features: Interlocking(Side); Package Description: Female Header, Pitch 5 mm, 1 x 2 Position, Height 10 mm, Tail Length 3.5 mm; Mounting Type: ThroughHole; Package Reference: THD; Packaging: Bulk; Series: Buchanan; Category: Connectors,Interconnects; Screw Material - Plating: Brass-NickelPlated
J5 J6 = CMP-1502-03326-2: NexarPartId: 78871140; Packaging: Box; RoHS: Non-Compliant; Number of Pins: 4; Lead Pitch: 5mm
TP16 = CMP-1672-00003-4: as TP13 on sheet Power; ComponentLink2URL: http://www.keyelco.com/product-pdf.cfm?p=1320; Colour: Black; Pins: 1; REACH SVHC: No SVHC; ComponentLink1URL: http://www.keyelco.com/; PackageReference: 5011; Contact Plating: Silver; Package Quantity: 100; Packaging: Bulk; RoHSCompliant: true; Height: 8.12 mm; PackageDescription: 1-Pin Through Hole Device, Dia 3.17 mm; Mount: Through Hole; Mounting Technology: Through Hole; DatasheetVersion: Rev. F, 12/2013; ComponentLink1Description: Manufacturer URL; Contact Material: Bronze; ComponentLink2Description: Datasheet

## Sheet Cables.SchDoc
size A4; DocumentNumber: 11; SheetNumber: 11; SheetTotal: 11
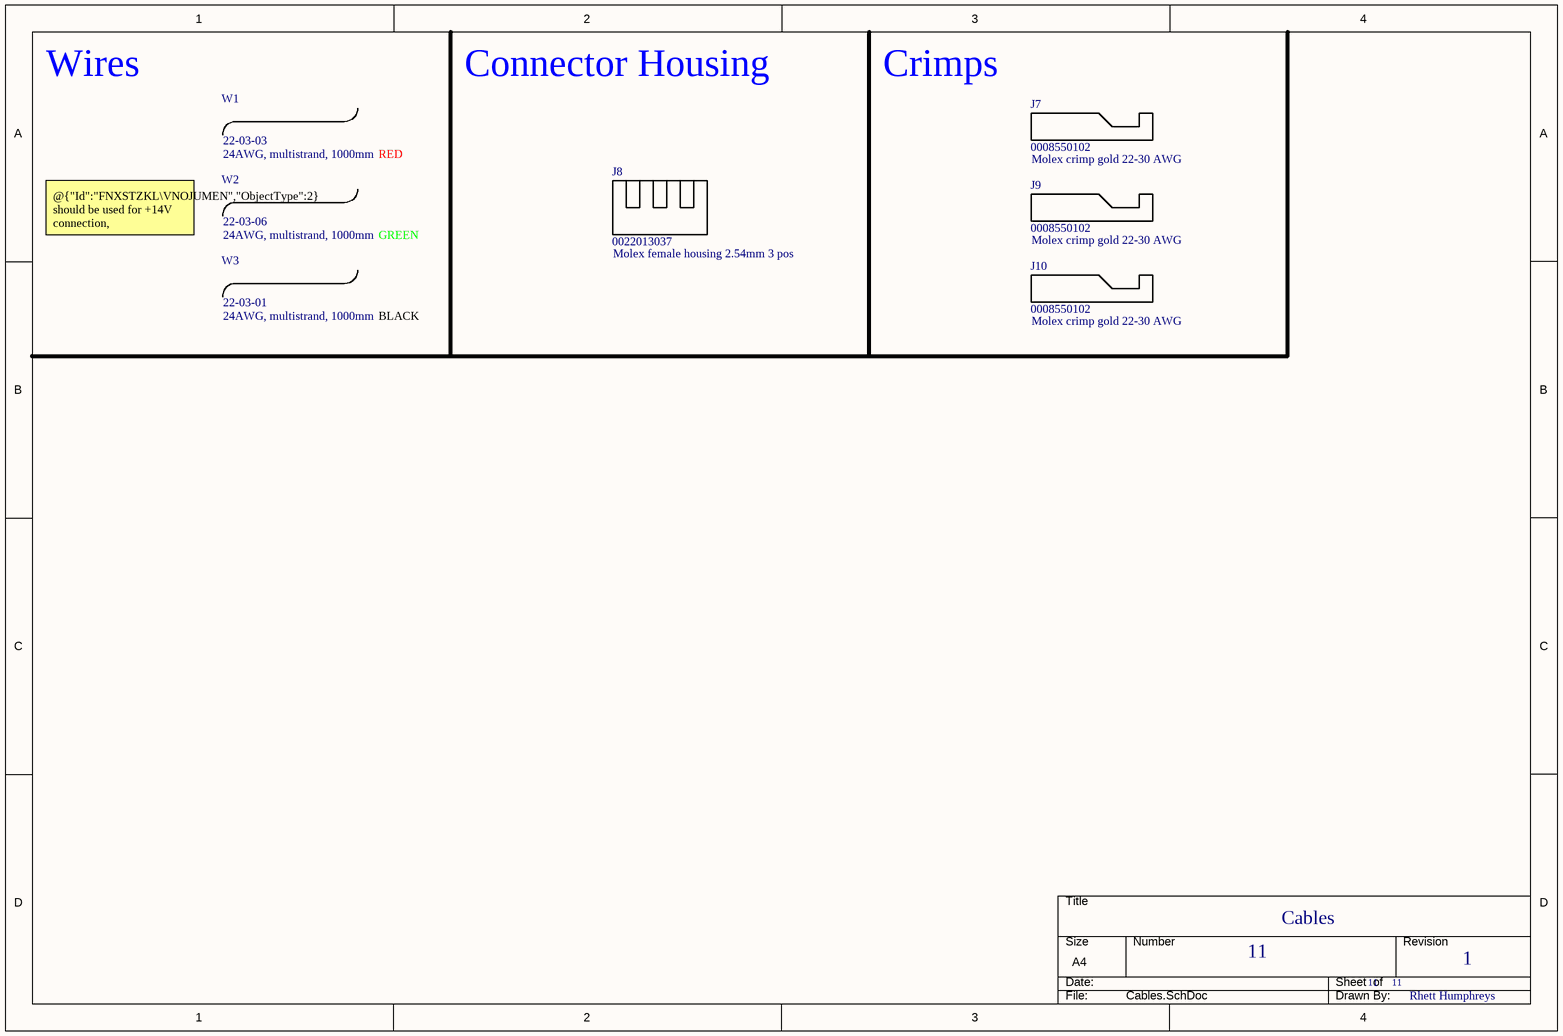
[diagram p10: Cables.SchDoc]

### Parts
J7  0008550102
J8  0022013037
J9  0008550102
J10  0008550102
W1  24AWG, multistrand, 1000mm
W2  24AWG, multistrand, 1000mm
W3  24AWG, multistrand, 1000mm

### Notes on the sheet
- Wires
- Connector Housing
- Crimps
- (near W1) 22-03-03
- RED
- Molex crimp gold 22-30 AWG
- @{"Id":"FNXSTZKL\VNOJUMEN","ObjectType":2} should be used for +14V connection, @{"Id":"FNXSTZKL\PRHJPKLT","ObjectType":2} for GND and @{"Id":"FNXSTZKL\YBQYJNNN","ObjectType":2} for -14V
- (near W2) 22-03-06
- GREEN
- (near W3) 22-03-01
- (near J8) Molex female housing 2.54mm 3 pos
- BLACK
- (near J10) Molex crimp gold 22-30 AWG
- Cables
- 11
- 1
- Rhett Humphreys

### Library data of the parts
W1-W3 = Wire 22AWG

## Nets that join several sheets
3V3: ATmega328p (13 pins), Seeeduino and Temp (6 pins), Channels [1,2] (8 pins), Channels [3,4] (8 pins), ADC (13 pins), Alarms and Buttons (25 pins), Accelerometer (5 pins), LCD (DISP1.2), Power (5 pins)
5V: LCD (DISP1.15), Power (9 pins)
+14V: Channels [1,2] (C11.2 C21.2 U3.4 U4.4), Channels [3,4] (C15.2 C17.2 U7.4 U8.4), Power (8 pins), Hardware (F1.2 TP14.1)
-14V: Channels [1,2] (C10.2 C20.2 U3.11 U4.11), Channels [3,4] (C14.2 C16.2 U7.11 U8.11), Hardware (F2.2 TP15.1)
GND: ATmega328p (14 pins), Seeeduino and Temp (6 pins), Channels [1,2] (16 pins), Channels [3,4] (16 pins), ADC (19 pins), Alarms and Buttons (10 pins), Accelerometer (6 pins), LCD (DISP1.1 DISP1.3 DISP1.16), Power (14 pins), Hardware (8 pins)
10uA_OUT: Power (R66.1 U18.6), Hardware (J3.1)
200uA_OUT: Power (R68.1 U20.6), Hardware (J4.1)
ADC1_RDY: ATmega328p (R7.2), ADC (R46.1 U11.2)
ADC2_RDY: ATmega328p (R5.2), ADC (R51.1 U13.2)
ADC_CH1: Channels [1,2] (U6.4), ADC (R47.1)
ADC_CH2: Channels [1,2] (U5.4), ADC (R48.1)
ADC_CH3: Channels [3,4] (U10.4), ADC (R52.1)
ADC_CH4: Channels [3,4] (U9.4), ADC (R53.1)
AVR_RX: ATmega328p (U1.30), Seeeduino and Temp (U21.6)
AVR_TX: ATmega328p (U1.31), Seeeduino and Temp (U21.5)
BTN1: ATmega328p (U1.24), Alarms and Buttons (C41.2 R60.1 SW2.1 SW2.2)
BTN2: ATmega328p (U1.23), Alarms and Buttons (C42.2 R61.1 SW3.1 SW3.2)
BTN3: ATmega328p (R4.2), Alarms and Buttons (C43.2 R62.1 SW4.1 SW4.2)
CHAN_SCALE: ATmega328p (U1.25), Channels [1,2] (R25.1 R26.1 U5.6 U6.6), Channels [3,4] (R43.1 R44.1 U9.6 U10.6)
I2C_SCL: ATmega328p (R2.2 U1.28), ADC (U11.10 U13.10), Accelerometer (U15.4)
I2C_SDA: ATmega328p (R1.2 U1.27), ADC (U11.9 U13.9), Accelerometer (U15.6)
IN_CH1: Channels [1,2] (U3.3), Hardware (J5.1)
IN_CH2: Channels [1,2] (U4.3), Hardware (J5.3)
IN_CH3: Channels [3,4] (U7.3), Hardware (J6.1)
IN_CH4: Channels [3,4] (U8.3), Hardware (J6.3)
LCD_D4: ATmega328p (U1.2), LCD (DISP1.11)
LCD_D5: ATmega328p (U1.11), LCD (DISP1.12)
LCD_D6: ATmega328p (U1.10), LCD (DISP1.13)
LCD_D7: ATmega328p (U1.9), LCD (DISP1.14)
LCD_E: ATmega328p (U1.12), LCD (DISP1.6)
LCD_RS: ATmega328p (U1.14), LCD (DISP1.4)
LCD_RW: ATmega328p (U1.13), LCD (DISP1.5)
LED_CLK: ATmega328p (U1.32), Alarms and Buttons (U16.3)
LED_SIN: ATmega328p (U1.1), Alarms and Buttons (U16.2)
TEMP_SENSE: ATmega328p (U1.22), Seeeduino and Temp (C9.2 R8.1 RT1.1)

## Assembly variants
V01: not fitted R25 R26 R44 R69
V02: all parts fitted